# EAGLE board CombinedBackplane01 (EAGLE 7.7.0), part 1 of 2
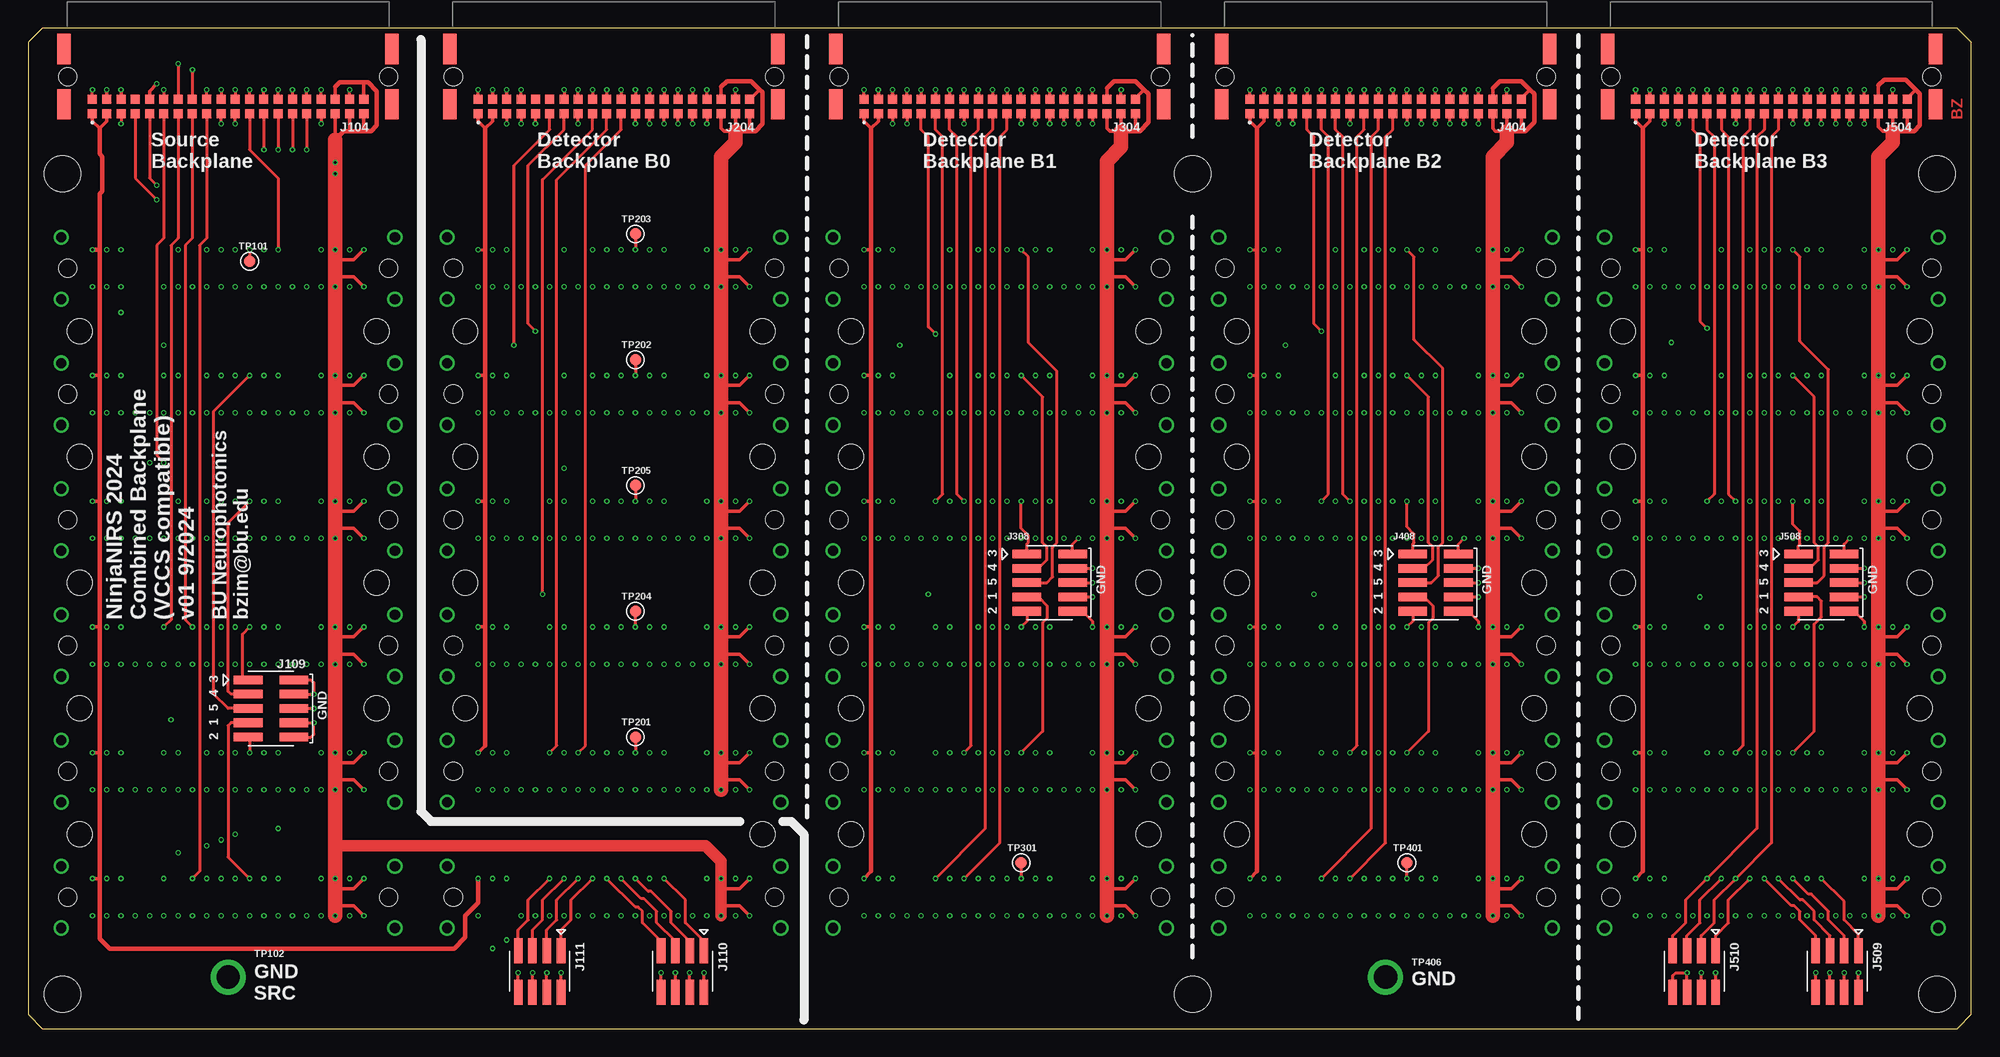
[diagram p5: board, top side]
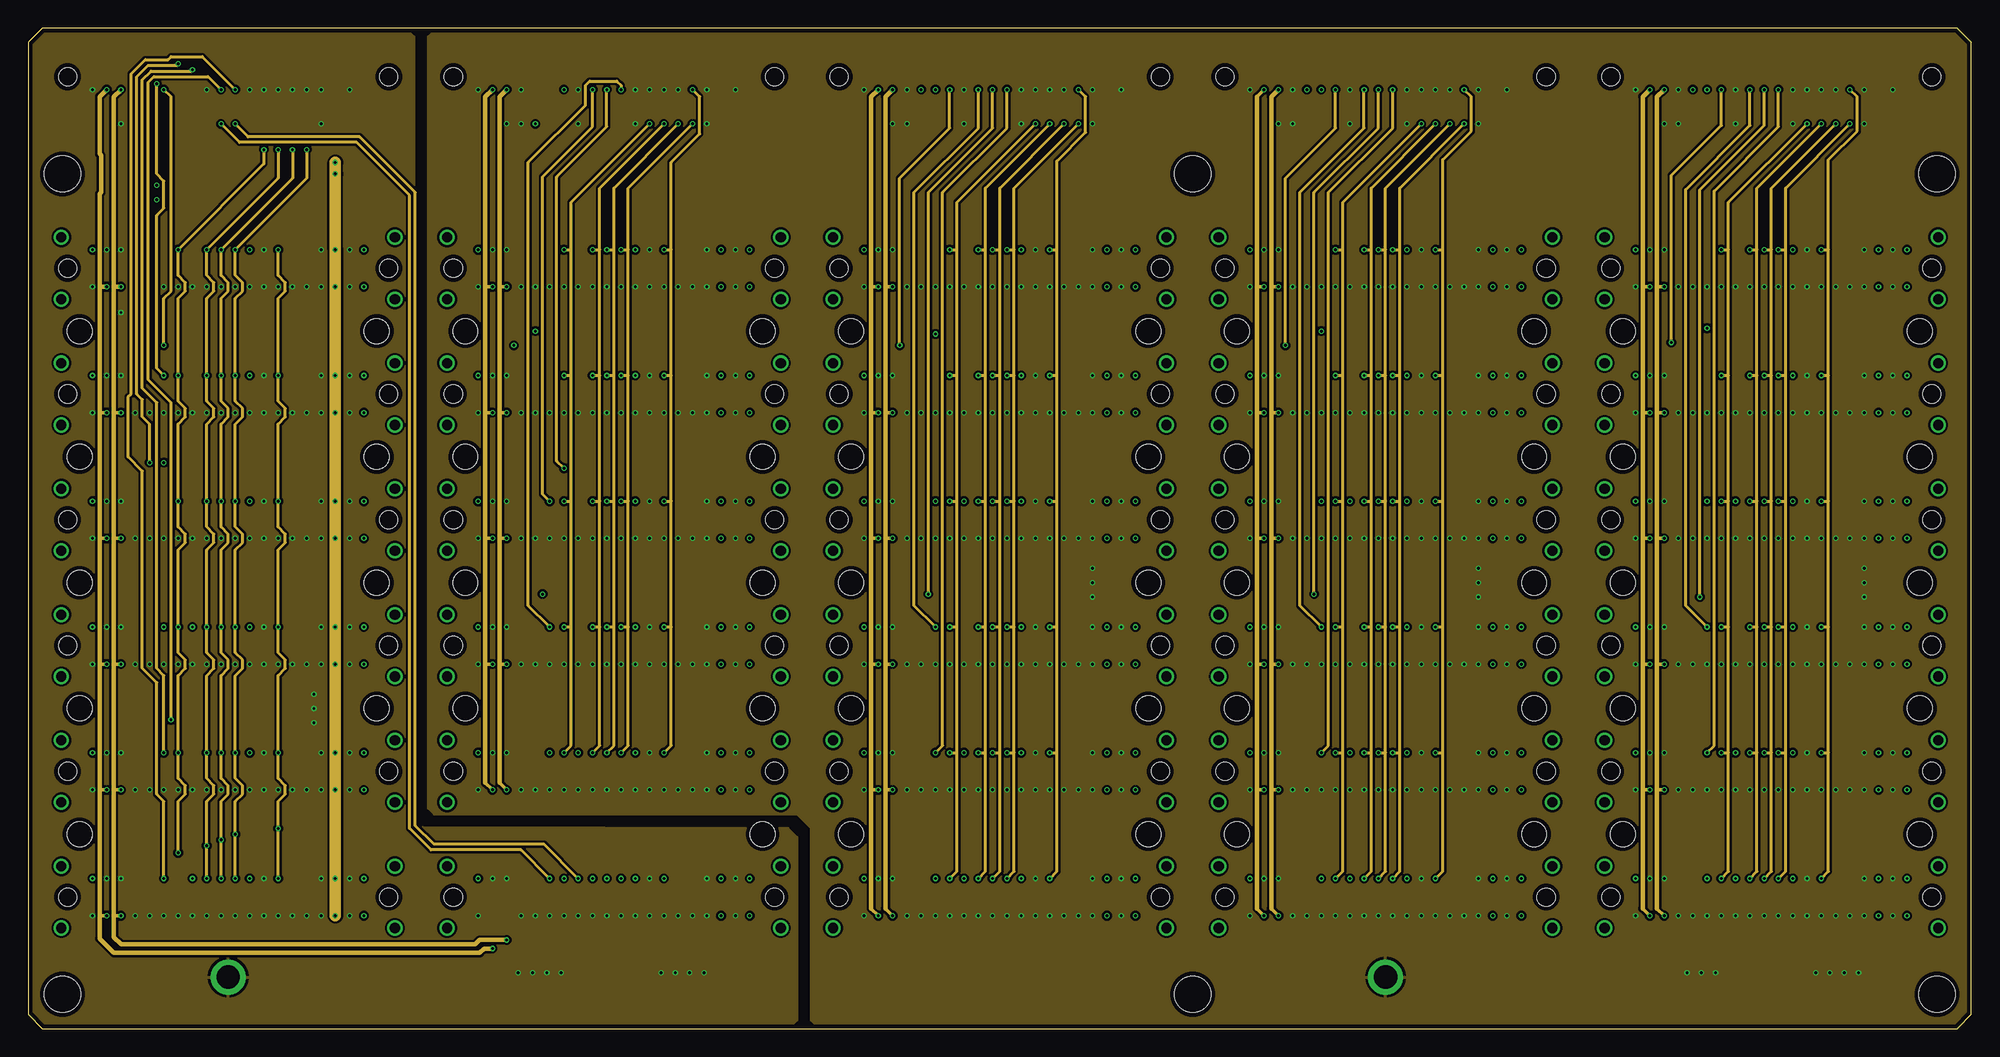
[diagram p6: board, inner layer Route2]
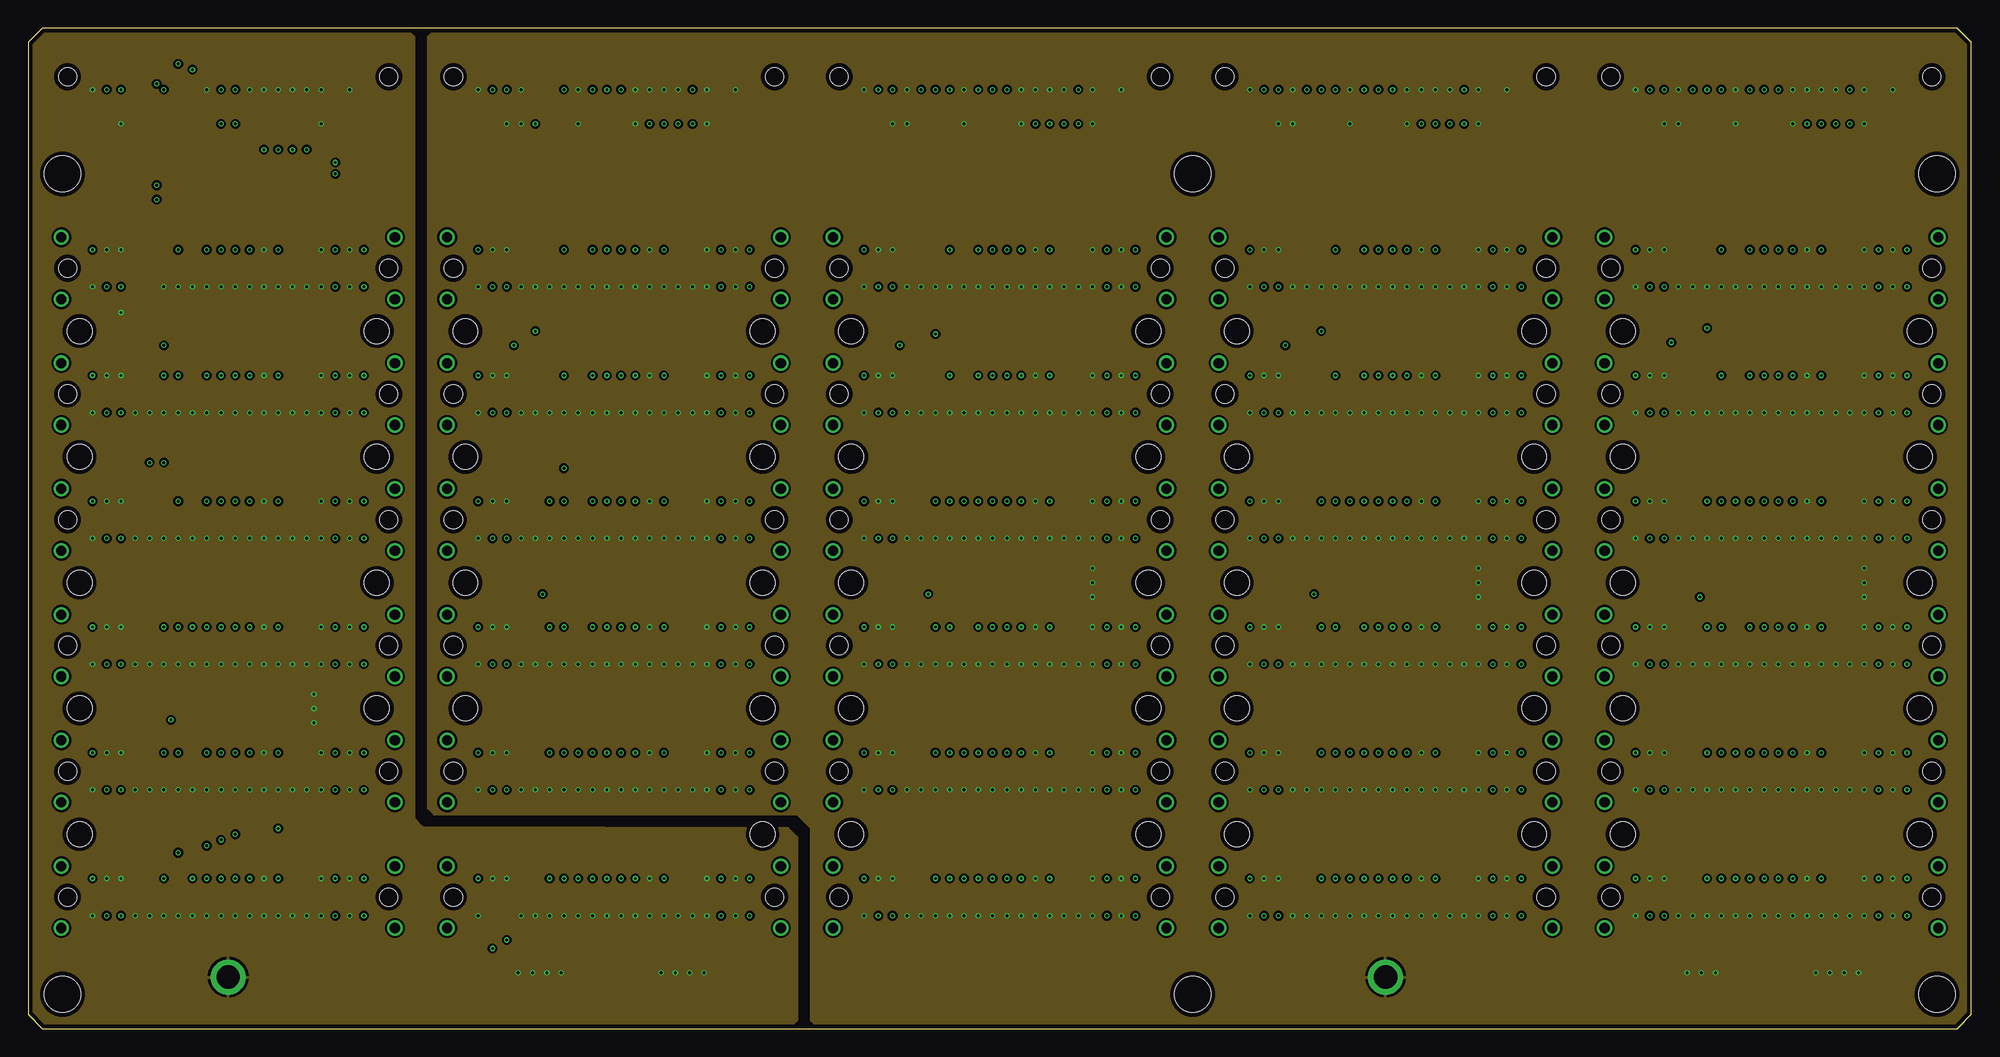
[diagram p7: board, inner layer Route15]
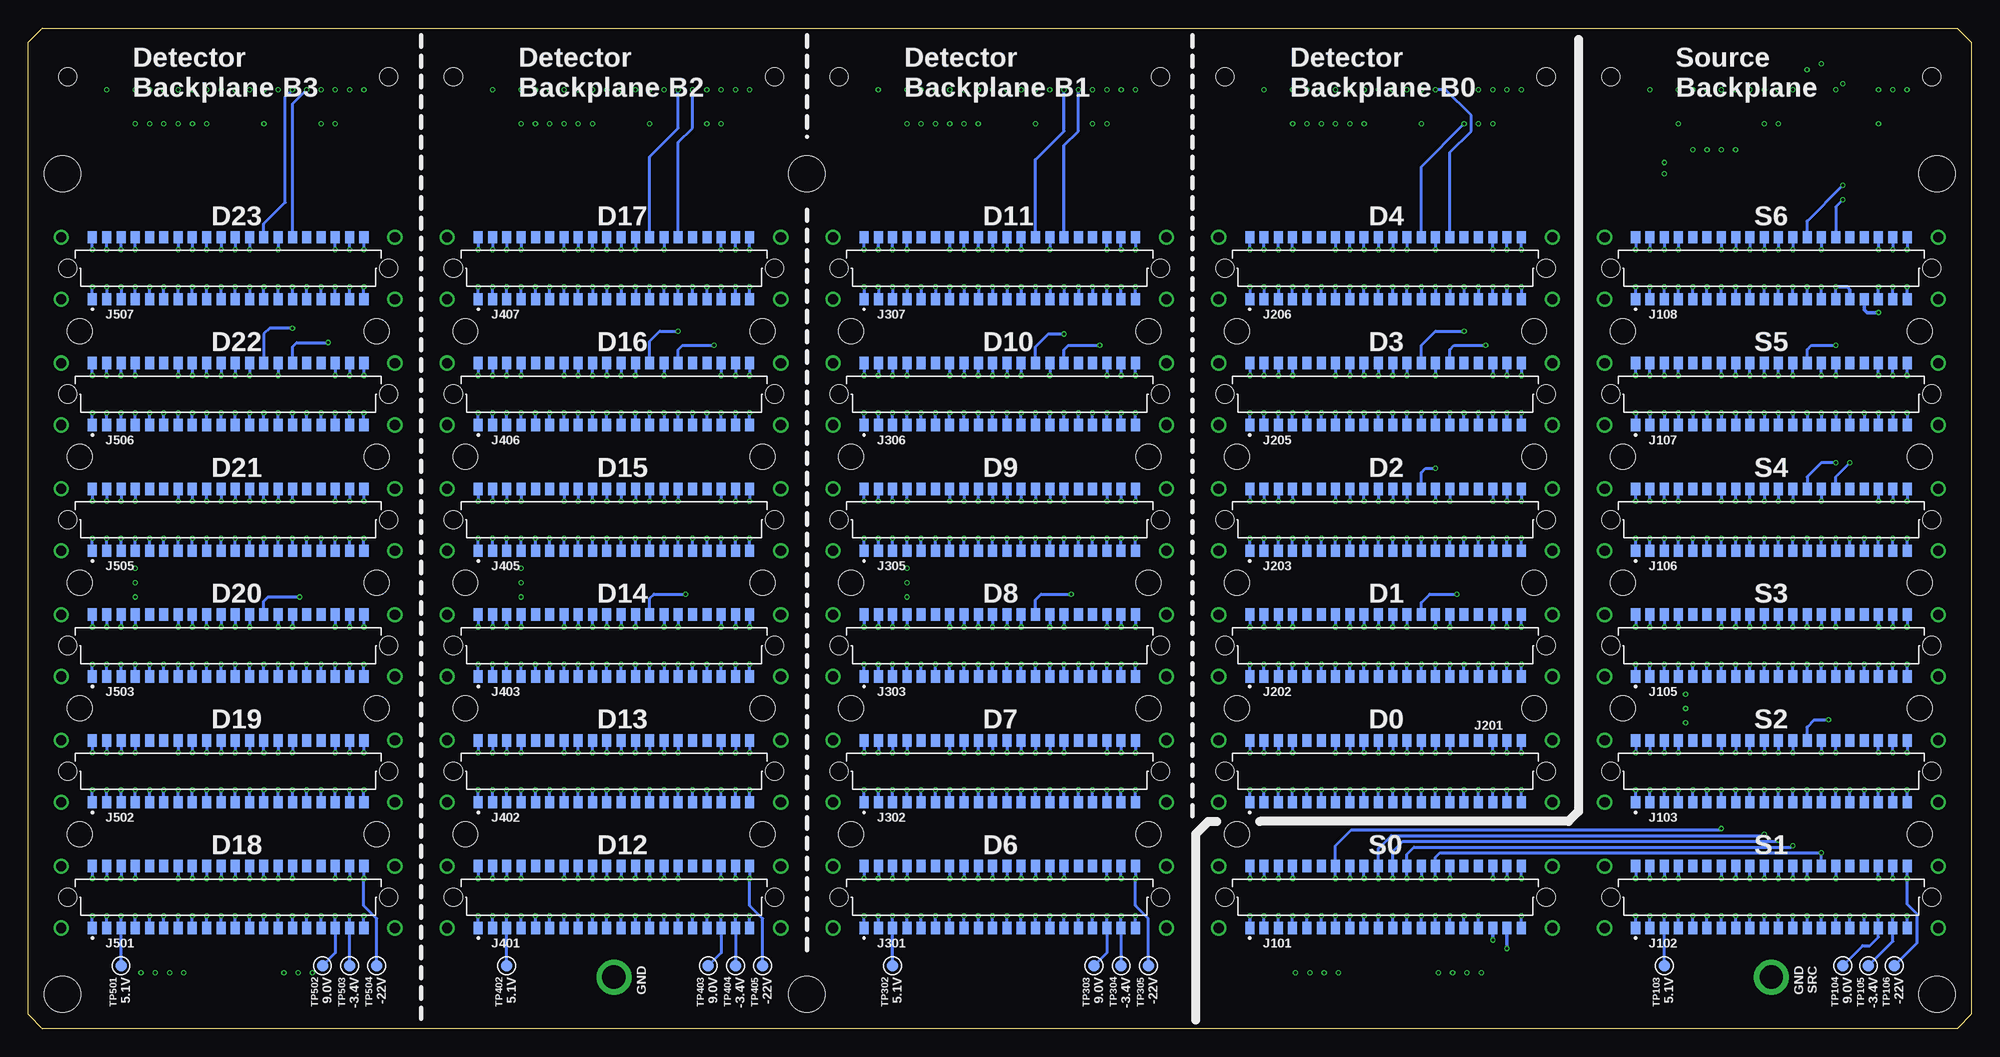
[diagram p8: board, bottom side, seen from below]

Size 172.72 x 88.9 mm. Coordinates in mm from the lower left corner, seen from the top.
Outline: 1.27,0 171.45,0 172.72,1.27 172.72,87.63 171.45,88.9 1.27,88.9 0,87.63 0,1.27 1.27,0
Copper layers (1*2*15*16): Top 0.035559375mm / dielectric 0.17018125mm / Route2 0.01778125mm / dielectric 47mil / Route15 0.01778125mm / dielectric 0.17018125mm / Bottom 0.035559375mm
Design rules "OSHPark-4layer *": minimum track width 5mil, minimum drill 10mil, track to track 5mil, track to pad 5mil, pad to pad 5mil, via to via 5mil, smd to smd 5mil, copper to edge 15mil, drill to drill 6mil, minimum pad ring 4mil, minimum via ring 4mil, stop-mask expansion 2.5mil, vias tented up to drill 12mil, thermal gap 10mil
Holes 2.2 mm at 4.57,28.45 4.57,17.27 30.99,28.45 4.57,39.62 4.57,50.8 30.99,39.62 30.99,50.8 4.57,61.98 30.99,61.98 38.86,28.45 38.86,39.62 38.86,50.8 38.86,61.98 73.15,28.45 73.15,17.27 73.15,39.62 73.15,50.8 73.15,61.98 107.44,28.45 107.44,17.27 107.44,39.62 107.44,50.8 107.44,61.98 141.73,28.45 141.73,17.27 141.73,39.62 141.73,50.8 141.73,61.98 65.28,28.45 65.28,39.62 65.28,50.8 65.28,61.98 99.57,28.45 99.57,17.27 99.57,39.62 99.57,50.8 99.57,61.98 133.86,28.45 133.86,17.27 133.86,39.62 133.86,50.8 133.86,61.98 168.15,28.45 168.15,17.27 168.15,39.62 168.15,50.8 168.15,61.98 65.28,17.27
Holes 3.2 mm at 3.05,3.05 169.67,3.05 103.5,3.05 103.5,75.95 169.67,75.95 3.05,75.95
tKeepout: area 100.5,72.9 to 106.6,79; area 166.6,72.9 to 172.7,79; area 0,0 to 6.1,6.1; area 100.5,0 to 106.6,6.1; area 166.6,0 to 172.7,6.1; area 0,72.9 to 6.1,79
tRestrict: 16 lines

## Footprints (pad centres in the part's own frame; a part is rotated, then mirrored left to right if it is on the bottom)
M20X2_HARFLEX_F_STR_MPTH = smd 0.8 x 1.1: A1 12.065,2.75; A2 10.795,2.75; A3 9.525,2.75; A4 8.255,2.75; A5 6.985,2.75; A6 5.715,2.75; A7 4.445,2.75; A8 3.175,2.75; A9 1.905,2.75; A10 0.635,2.75; A11 -0.635,2.75; A12 -1.905,2.75; A13 -3.175,2.75; A14 -4.445,2.75; A15 -5.715,2.75; A16 -6.985,2.75; A17 -8.255,2.75; A18 -9.525,2.75; A19 -10.795,2.75; A20 -12.065,2.75; B1 12.065,-2.75; B2 10.795,-2.75; B3 9.525,-2.75; B4 8.255,-2.75; B5 6.985,-2.75; B6 5.715,-2.75; B7 4.445,-2.75; B8 3.175,-2.75; B9 1.905,-2.75; B10 0.635,-2.75; B11 -0.635,-2.75; B12 -1.905,-2.75; B13 -3.175,-2.75; B14 -4.445,-2.75; B15 -5.715,-2.75; B16 -6.985,-2.75; B17 -8.255,-2.75; B18 -9.525,-2.75; B19 -10.795,-2.75; B20 -12.065,-2.75 | drill 0.9 pad 1.35: M1 -14.825,2.75; M2 14.825,2.75; M3 -14.825,-2.75; M4 14.825,-2.75 | hole 1.6: -14.275,0; 14.275,0
M20X2_HARFLEX_M = smd 0.8 x 0.8: A1 12.065,2; A2 10.795,2; A3 9.525,2; A4 8.255,2; A5 6.985,2; A6 5.715,2; A7 4.445,2; A8 3.175,2; A9 1.905,2; A10 0.635,2; A11 -0.635,2; A12 -1.905,2; A13 -3.175,2; A14 -4.445,2; A15 -5.715,2; A16 -6.985,2; A17 -8.255,2; A18 -9.525,2; A19 -10.795,2; A20 -12.065,2; B1 12.065,3.27; B2 10.795,3.27; B3 9.525,3.27; B4 8.255,3.27; B5 6.985,3.27; B6 5.715,3.27; B7 4.445,3.27; B8 3.175,3.27; B9 1.905,3.27; B10 0.635,3.27; B11 -0.635,3.27; B12 -1.905,3.27; B13 -3.175,3.27; B14 -4.445,3.27; B15 -5.715,3.27; B16 -6.985,3.27; B17 -8.255,3.27; B18 -9.525,3.27; B19 -10.795,3.27; B20 -12.065,3.27 | smd 1.2 x 2.7: P$17 -14.575,2.45; P$18 -14.575,-2.45; P$19 14.575,2.45; P$20 14.575,-2.45 | hole 1.6: -14.275,0; 14.275,0
M05X2_0.050_SMD_NO_CREAM = smd 2.54 x 0.762: 1 -2.032,2.54; 2 2.032,2.54; 3 -2.032,1.27; 4 2.032,1.27; 5 -2.032,0; 6 2.032,0; 7 -2.032,-1.27; 8 2.032,-1.27; 9 -2.032,-2.54; 10 2.032,-2.54
M04X2_0.050_SMD_NO_CREAM = smd 2.21 x 0.762: 1 -1.841,1.905; 2 1.841,1.905; 3 -1.841,0.635; 4 1.841,0.635; 5 -1.841,-0.635; 6 1.841,-0.635; 7 -1.841,-1.905; 8 1.841,-1.905
TESTPAD_ROUND = smd 1.016 x 1.016: P$1 0,0
TURRET = drill 2.08: P$1 0,0

## Placement (x,y rotation side)
J101  M20X2_STR_MPTH  [M20X2_HARFLEX_F_STR_MPTH]  52.07,11.68 180 bottom
J102  M20X2_STR_MPTH  [M20X2_HARFLEX_F_STR_MPTH]  17.78,11.68 180 bottom
J103  M20X2_STR_MPTH  [M20X2_HARFLEX_F_STR_MPTH]  17.78,22.86 180 bottom
J104  M20X2_HARFLEX_M  [M20X2_HARFLEX_M]  17.78,84.58 180 top
J105  M20X2_STR_MPTH  [M20X2_HARFLEX_F_STR_MPTH]  17.78,34.04 180 bottom
J106  M20X2_STR_MPTH  [M20X2_HARFLEX_F_STR_MPTH]  17.78,45.21 180 bottom
J107  M20X2_STR_MPTH  [M20X2_HARFLEX_F_STR_MPTH]  17.78,56.39 180 bottom
J108  M20X2_STR_MPTH  [M20X2_HARFLEX_F_STR_MPTH]  17.78,67.56 180 bottom
J109  M05X2_SMD_0.050_NOCREAM  [M05X2_0.050_SMD_NO_CREAM]  21.59,28.45 0 top
J110  M04X2_0.050_SMD_NO_CREAM  [M04X2_0.050_SMD_NO_CREAM]  58.17,5.08 270 top
J111  M04X2_0.050_SMD_NO_CREAM  [M04X2_0.050_SMD_NO_CREAM]  45.47,5.08 270 top
J201  M20X2_STR_MPTH  [M20X2_HARFLEX_F_STR_MPTH]  52.07,22.86 180 bottom
J202  M20X2_STR_MPTH  [M20X2_HARFLEX_F_STR_MPTH]  52.07,34.04 180 bottom
J203  M20X2_STR_MPTH  [M20X2_HARFLEX_F_STR_MPTH]  52.07,45.21 180 bottom
J204  M20X2_HARFLEX_M  [M20X2_HARFLEX_M]  52.07,84.58 180 top
J205  M20X2_STR_MPTH  [M20X2_HARFLEX_F_STR_MPTH]  52.07,56.39 180 bottom
J206  M20X2_STR_MPTH  [M20X2_HARFLEX_F_STR_MPTH]  52.07,67.56 180 bottom
J301  M20X2_STR_MPTH  [M20X2_HARFLEX_F_STR_MPTH]  86.36,11.68 180 bottom
J302  M20X2_STR_MPTH  [M20X2_HARFLEX_F_STR_MPTH]  86.36,22.86 180 bottom
J303  M20X2_STR_MPTH  [M20X2_HARFLEX_F_STR_MPTH]  86.36,34.04 180 bottom
J304  M20X2_HARFLEX_M  [M20X2_HARFLEX_M]  86.36,84.58 180 top
J305  M20X2_STR_MPTH  [M20X2_HARFLEX_F_STR_MPTH]  86.36,45.21 180 bottom
J306  M20X2_STR_MPTH  [M20X2_HARFLEX_F_STR_MPTH]  86.36,56.39 180 bottom
J307  M20X2_STR_MPTH  [M20X2_HARFLEX_F_STR_MPTH]  86.36,67.56 180 bottom
J308  M05X2_SMD_0.050_NOCREAM  [M05X2_0.050_SMD_NO_CREAM]  90.81,39.62 0 top
J401  M20X2_STR_MPTH  [M20X2_HARFLEX_F_STR_MPTH]  120.65,11.68 180 bottom
J402  M20X2_STR_MPTH  [M20X2_HARFLEX_F_STR_MPTH]  120.65,22.86 180 bottom
J403  M20X2_STR_MPTH  [M20X2_HARFLEX_F_STR_MPTH]  120.65,34.04 180 bottom
J404  M20X2_HARFLEX_M  [M20X2_HARFLEX_M]  120.65,84.58 180 top
J405  M20X2_STR_MPTH  [M20X2_HARFLEX_F_STR_MPTH]  120.65,45.21 180 bottom
J406  M20X2_STR_MPTH  [M20X2_HARFLEX_F_STR_MPTH]  120.65,56.39 180 bottom
J407  M20X2_STR_MPTH  [M20X2_HARFLEX_F_STR_MPTH]  120.65,67.56 180 bottom
J408  M05X2_SMD_0.050_NOCREAM  [M05X2_0.050_SMD_NO_CREAM]  125.09,39.62 0 top
J501  M20X2_STR_MPTH  [M20X2_HARFLEX_F_STR_MPTH]  154.94,11.68 180 bottom
J502  M20X2_STR_MPTH  [M20X2_HARFLEX_F_STR_MPTH]  154.94,22.86 180 bottom
J503  M20X2_STR_MPTH  [M20X2_HARFLEX_F_STR_MPTH]  154.94,34.04 180 bottom
J504  M20X2_HARFLEX_M  [M20X2_HARFLEX_M]  154.94,84.58 180 top
J505  M20X2_STR_MPTH  [M20X2_HARFLEX_F_STR_MPTH]  154.94,45.21 180 bottom
J506  M20X2_STR_MPTH  [M20X2_HARFLEX_F_STR_MPTH]  154.94,56.39 180 bottom
J507  M20X2_STR_MPTH  [M20X2_HARFLEX_F_STR_MPTH]  154.94,67.56 180 bottom
J508  M05X2_SMD_0.050_NOCREAM  [M05X2_0.050_SMD_NO_CREAM]  159.38,39.62 0 top
J509  M04X2_0.050_SMD_NO_CREAM  [M04X2_0.050_SMD_NO_CREAM]  160.78,5.08 270 top
J510  M04X2_0.050_SMD_NO_CREAM  [M04X2_0.050_SMD_NO_CREAM]  148.08,5.08 270 top
TP101  TESTPOINT_ROUND  [TESTPAD_ROUND]  19.68,68.2 0 top
TP102  TESTPOINTTUR  [TURRET]  17.78,4.57 0 top
TP103  TESTPOINT_ROUND  [TESTPAD_ROUND]  27.3,5.59 0 bottom
TP104  TESTPOINT_ROUND  [TESTPAD_ROUND]  11.43,5.59 0 bottom
TP105  TESTPOINT_ROUND  [TESTPAD_ROUND]  9.14,5.59 0 bottom
TP106  TESTPOINT_ROUND  [TESTPAD_ROUND]  6.86,5.59 0 bottom
TP201  TESTPOINT_ROUND  [TESTPAD_ROUND]  53.98,25.91 0 top
TP202  TESTPOINT_ROUND  [TESTPAD_ROUND]  53.98,59.44 0 top
TP203  TESTPOINT_ROUND  [TESTPAD_ROUND]  53.98,70.61 0 top
TP204  TESTPOINT_ROUND  [TESTPAD_ROUND]  53.98,37.08 0 top
TP205  TESTPOINT_ROUND  [TESTPAD_ROUND]  53.98,48.26 0 top
TP301  TESTPOINT_ROUND  [TESTPAD_ROUND]  88.27,14.73 0 top
TP302  TESTPOINT_ROUND  [TESTPAD_ROUND]  95.89,5.59 180 bottom
TP303  TESTPOINT_ROUND  [TESTPAD_ROUND]  77.98,5.59 180 bottom
TP304  TESTPOINT_ROUND  [TESTPAD_ROUND]  75.56,5.59 180 bottom
TP305  TESTPOINT_ROUND  [TESTPAD_ROUND]  73.15,5.59 180 bottom
TP401  TESTPOINT_ROUND  [TESTPAD_ROUND]  122.56,14.73 0 top
TP402  TESTPOINT_ROUND  [TESTPAD_ROUND]  130.18,5.59 180 bottom
TP403  TESTPOINT_ROUND  [TESTPAD_ROUND]  112.27,5.59 180 bottom
TP404  TESTPOINT_ROUND  [TESTPAD_ROUND]  109.86,5.59 180 bottom
TP405  TESTPOINT_ROUND  [TESTPAD_ROUND]  107.44,5.59 180 bottom
TP406  TESTPOINTTUR  [TURRET]  120.65,4.57 0 top
TP501  TESTPOINT_ROUND  [TESTPAD_ROUND]  164.47,5.59 180 bottom
TP502  TESTPOINT_ROUND  [TESTPAD_ROUND]  146.56,5.59 180 bottom
TP503  TESTPOINT_ROUND  [TESTPAD_ROUND]  144.15,5.59 180 bottom
TP504  TESTPOINT_ROUND  [TESTPAD_ROUND]  141.73,5.59 180 bottom

## Tracks (layer width: path | path; a pad name or v marks a point on that pad's centre or on a via)
DET0_C0  (via drill 0.25)
  Top 0.254: v59.05,80.39 J204.B16
  Route2 0.254: v52.7,24.51 53.34,25.15 53.34,35.69 | 53.34,35.69 53.34,46.86 | 53.34,46.86 53.34,58.04 | 53.34,58.04 53.34,69.22 | v52.7,69.22 53.34,69.22 | v52.7,58.04 53.34,58.04 | v52.7,46.86 53.34,46.86 | v52.7,35.69 53.34,35.69 | 53.34,69.22 53.34,74.68 v59.05,80.39
  Bottom 0.254: J206.B10 v52.7,69.22 | J205.B10 v52.7,58.04 | J203.B10 v52.7,46.86 | J202.B10 v52.7,35.69 | J201.B10 v52.7,24.51
DET0_C1  (via drill 0.25)
  Top 0.254: v57.78,80.39 J204.B15
  Route2 0.254: v51.44,24.51 52.07,25.15 52.07,35.69 | 52.07,35.69 52.07,46.86 | 52.07,46.86 52.07,58.04 | 52.07,58.04 52.07,69.22 | v51.44,69.22 52.07,69.22 | v51.44,58.04 52.07,58.04 | v51.44,46.86 52.07,46.86 | v51.44,35.69 52.07,35.69 | 52.07,69.22 52.07,74.68 v57.78,80.39
  Bottom 0.254: J206.B11 v51.44,69.22 | J205.B11 v51.44,58.04 | J203.B11 v51.44,46.86 | J202.B11 v51.44,35.69 | J201.B11 v51.44,24.51
DET0_C2  (via drill 0.25)
  Top 0.254: v56.52,80.39 J204.B14
  Route2 0.254: v50.16,24.51 50.8,25.15 50.8,35.69 | 50.8,35.69 50.8,46.86 | 50.8,46.86 50.8,58.04 | 50.8,58.04 50.8,69.22 | v50.16,69.22 50.8,69.22 | v50.16,58.04 50.8,58.04 | v50.16,46.86 50.8,46.86 | v50.16,35.69 50.8,35.69 | 50.8,69.22 50.8,74.68 v56.52,80.39
  Bottom 0.254: J206.B12 v50.16,69.22 | J205.B12 v50.16,58.04 | J203.B12 v50.16,46.86 | J202.B12 v50.16,35.69 | J201.B12 v50.16,24.51
DET0_C3  (via drill 0.25)
  Top 0.254: v55.24,80.39 J204.B13
  Route2 0.254: v47.62,24.51 48.26,25.15 48.26,35.69 | 48.26,35.69 48.26,46.86 | 48.26,46.86 48.26,58.04 | 48.26,58.04 48.26,69.22 | 48.26,69.22 48.26,73.41 v55.24,80.39 | v47.62,69.22 48.26,69.22 | v47.62,58.04 48.26,58.04 | v47.62,46.86 48.26,46.86 | v47.62,35.69 48.26,35.69
  Bottom 0.254: J206.B14 v47.62,69.22 | J205.B14 v47.62,58.04 | J203.B14 v47.62,46.86 | J202.B14 v47.62,35.69 | J201.B14 v47.62,24.51
DET0_D0  (via drill 0.25)
  Top 0.254: v48.9,24.51 49.53,25.15 49.53,76.71 52.7,79.88 J204.B11
  Bottom 0.254: J201.B13 v48.9,24.51
DET0_D1  (via drill 0.25)
  Top 0.254: v46.35,24.51 46.99,25.15 46.99,75.44 51.44,79.88 J204.B10
  Bottom 0.254: J201.B15 v46.35,24.51
DET0_D2  (via drill 0.25)
  Top 0.254: v45.72,38.61 45.72,75.44 50.16,79.88 J204.B9
  Bottom 0.254: J202.B13 48.9,37.85 48.13,38.61 v45.72,38.61
DET0_D3  (via drill 0.25)
  Top 0.254: v52.7,83.44 J204.A11
  Route2 0.254: v46.35,35.69 44.45,37.59 44.45,76.96 49.53,82.04 49.53,83.82 49.91,84.2 52.32,84.2 52.7,83.82 v52.7,83.44
  Bottom 0.254: J202.B15 v46.35,35.69
DET0_D4  (via drill 0.25)
  Top 0.254: v51.44,83.44 J204.A10
  Route2 0.254: v47.62,49.78 46.99,50.42 46.99,75.69 51.44,80.14 v51.44,83.44
  Bottom 0.254: J203.B13 48.9,49.4 48.51,49.78 v47.62,49.78
DET0_D5  (via drill 0.25)
  Top 0.254: v50.16,83.44 J204.A9
  Route2 0.254: v46.35,46.86 45.72,47.5 45.72,75.69 50.16,80.14 v50.16,83.44
  Bottom 0.254: J203.B15 v46.35,46.86
DET0_D6  (via drill 0.25)
  Top 0.254: v45.09,61.98 44.45,62.61 44.45,76.71 47.62,79.88 J204.B7
  Bottom 0.254: J205.B13 48.9,60.71 47.62,61.98 v45.09,61.98
DET0_D7  (via drill 0.25)
  Top 0.254: v43.18,60.71 43.18,76.71 46.35,79.88 J204.B6
  Bottom 0.254: J205.B15 46.35,60.33 45.97,60.71 v43.18,60.71
DET0_D8  (via drill 0.25)
  Top 0.254: v45.09,80.39 J204.B5
  Bottom 0.254: J206.B13 48.9,76.58 v45.09,80.39
DET0_D9  (via drill 0.25)
  Top 0.254: v47.62,83.44 J204.A7
  Bottom 0.254: J206.B15 46.35,77.85 44.45,79.76 44.45,81.15 46.74,83.44 v47.62,83.44
DET1_C0  (via drill 0.25)
  Top 0.254: v93.34,80.39 J304.B16
  Route2 0.254: v87,13.34 87.63,13.97 87.63,24.51 | 87.63,24.51 87.63,35.69 | 87.63,35.69 87.63,46.86 | 87.63,46.86 87.63,58.04 | 87.63,58.04 87.63,69.22 | v87,69.22 87.63,69.22 | v87,58.04 87.63,58.04 | v87,46.86 87.63,46.86 | v87,35.69 87.63,35.69 | v87,24.51 87.63,24.51 | 87.63,69.22 87.63,74.68 v93.34,80.39
  Bottom 0.254: J307.B10 v87,69.22 | J306.B10 v87,58.04 | J305.B10 v87,46.86 | J303.B10 v87,35.69 | J302.B10 v87,24.51 | J301.B10 v87,13.34
DET1_C1  (via drill 0.25)
  Top 0.254: v92.08,80.39 J304.B15
  Route2 0.254: v85.72,13.34 86.36,13.97 86.36,24.51 | 86.36,24.51 86.36,35.69 | 86.36,35.69 86.36,46.86 | 86.36,46.86 86.36,58.04 | 86.36,58.04 86.36,69.22 | v85.72,69.22 86.36,69.22 | v85.72,58.04 86.36,58.04 | v85.72,46.86 86.36,46.86 | v85.72,35.69 86.36,35.69 | v85.72,24.51 86.36,24.51 | 86.36,69.22 86.36,74.68 v92.08,80.39
  Bottom 0.254: J307.B11 v85.72,69.22 | J306.B11 v85.72,58.04 | J305.B11 v85.72,46.86 | J303.B11 v85.72,35.69 | J302.B11 v85.72,24.51 | J301.B11 v85.72,13.34
DET1_C2  (via drill 0.25)
  Top 0.254: v90.81,80.39 J304.B14
  Route2 0.254: v84.45,13.34 85.09,13.97 85.09,24.51 | 85.09,24.51 85.09,35.69 | 85.09,35.69 85.09,46.86 | 85.09,46.86 85.09,58.04 | 85.09,58.04 85.09,69.22 | v84.45,69.22 85.09,69.22 | v84.45,58.04 85.09,58.04 | v84.45,46.86 85.09,46.86 | v84.45,35.69 85.09,35.69 | v84.45,24.51 85.09,24.51 | 85.09,69.22 85.09,74.68 v90.81,80.39
  Bottom 0.254: J307.B12 v84.45,69.22 | J306.B12 v84.45,58.04 | J305.B12 v84.45,46.86 | J303.B12 v84.45,35.69 | J302.B12 v84.45,24.51 | J301.B12 v84.45,13.34
DET1_C3  (via drill 0.25)
  Top 0.254: v89.53,80.39 J304.B13
  Route2 0.254: v81.92,13.34 82.55,13.97 82.55,24.51 | 82.55,24.51 82.55,35.69 | 82.55,35.69 82.55,46.86 | 82.55,46.86 82.55,58.04 | 82.55,58.04 82.55,69.22 | 82.55,69.22 82.55,73.41 v89.53,80.39 | v81.92,69.22 82.55,69.22 | v81.92,58.04 82.55,58.04 | v81.92,46.86 82.55,46.86 | v81.92,35.69 82.55,35.69 | v81.92,24.51 82.55,24.51
  Bottom 0.254: J307.B14 v81.92,69.22 | J306.B14 v81.92,58.04 | J305.B14 v81.92,46.86 | J303.B14 v81.92,35.69 | J302.B14 v81.92,24.51 | J301.B14 v81.92,13.34
DET1_D0  (via drill 0.25)
  Top 0.254: v83.19,13.34 86.36,16.51 86.36,79.25 87,79.88 J304.B11
  Bottom 0.254: J301.B13 v83.19,13.34
DET1_D1  (via drill 0.25)
  Top 0.254: v80.64,13.34 85.09,17.78 85.09,79.25 85.72,79.88 J304.B10
  Bottom 0.254: J301.B15 v80.64,13.34
DET1_D2  (via drill 0.25)
  Top 0.254: v83.19,24.51 83.82,25.15 83.82,79.25 84.45,79.88 J304.B9
  Bottom 0.254: J302.B13 v83.19,24.51
DET1_D3  (via drill 0.25)
  Top 0.254: v87,83.44 J304.A11
  Route2 0.254: v80.64,24.51 81.28,25.15 81.28,74.3 87,80.01 v87,83.44
  Bottom 0.254: J302.B15 v80.64,24.51
DET1_D4  (via drill 0.25)
  Top 0.254: v85.72,83.44 J304.A10
  Route2 0.254: v80.01,38.61 80.01,74.3 85.72,80.01 v85.72,83.44
  Bottom 0.254: J303.B13 83.19,38.1 82.68,38.61 v80.01,38.61
DET1_D5  (via drill 0.25)
  Top 0.254: v84.45,83.44 J304.A9
  Route2 0.254: v80.64,35.69 78.74,37.59 78.74,74.3 84.45,80.01 v84.45,83.44
  Bottom 0.254: J303.B15 v80.64,35.69
DET1_D6  (via drill 0.25)
  Top 0.254: v83.19,46.86 82.55,47.5 82.55,79.25 81.92,79.88 J304.B7
  Bottom 0.254: J305.B13 v83.19,46.86
DET1_D7  (via drill 0.25)
  Top 0.254: v80.64,46.86 81.28,47.5 81.28,79.25 80.64,79.88 J304.B6
  Bottom 0.254: J305.B15 v80.64,46.86
DET1_D8  (via drill 0.25)
  Top 0.254: v80.64,61.72 80.01,62.36 80.01,79.25 79.38,79.88 J304.B5
  Bottom 0.254: J306.B13 83.19,60.58 82.04,61.72 v80.64,61.72
DET1_D9  (via drill 0.25)
  Top 0.254: v81.92,83.44 J304.A7
  Route2 0.254: v77.47,60.71 77.47,75.56 81.92,80.01 v81.92,83.44
  Bottom 0.254: J306.B15 80.64,60.33 80.26,60.71 v77.47,60.71
DET1_D10  (via drill 0.25)
  Top 0.254: v80.64,83.44 J304.A6
  Bottom 0.254: J307.B13 83.19,77.22 80.64,79.76 v80.64,83.44
DET1_D11  (via drill 0.25)
  Top 0.254: v79.38,83.44 J304.A5
  Bottom 0.254: J307.B15 80.64,78.49 79.38,79.76 v79.38,83.44
DET2_C0  (via drill 0.25)
  Top 0.254: v127.64,80.39 J404.B16
  Route2 0.254: v121.28,13.34 121.92,13.97 121.92,24.51 | 121.92,24.51 121.92,35.69 | 121.92,35.69 121.92,46.86 | 121.92,46.86 121.92,58.04 | 121.92,58.04 121.92,69.22 | v121.28,24.51 121.92,24.51 | v121.28,35.69 121.92,35.69 | v121.28,46.86 121.92,46.86 | v121.28,58.04 121.92,58.04 | v121.28,69.22 121.92,69.22 | 121.92,69.22 121.92,74.68 v127.64,80.39
  Bottom 0.254: J401.B10 v121.28,13.34 | J402.B10 v121.28,24.51 | J403.B10 v121.28,35.69 | J405.B10 v121.28,46.86 | J406.B10 v121.28,58.04 | J407.B10 v121.28,69.22
DET2_C1  (via drill 0.25)
  Top 0.254: v126.36,80.39 J404.B15
  Route2 0.254: v120.02,13.34 120.65,13.97 120.65,24.51 | 120.65,24.51 120.65,35.69 | 120.65,35.69 120.65,46.86 | 120.65,46.86 120.65,58.04 | 120.65,58.04 120.65,69.22 | v120.02,24.51 120.65,24.51 | v120.02,35.69 120.65,35.69 | v120.02,46.86 120.65,46.86 | v120.02,58.04 120.65,58.04 | v120.02,69.22 120.65,69.22 | 120.65,69.22 120.65,74.68 v126.36,80.39
  Bottom 0.254: J401.B11 v120.02,13.34 | J402.B11 v120.02,24.51 | J403.B11 v120.02,35.69 | J405.B11 v120.02,46.86 | J406.B11 v120.02,58.04 | J407.B11 v120.02,69.22
DET2_C2  (via drill 0.25)
  Top 0.254: v125.09,80.39 J404.B14
  Route2 0.254: v118.75,13.34 119.38,13.97 119.38,24.51 | 119.38,24.51 119.38,35.69 | 119.38,35.69 119.38,46.86 | 119.38,46.86 119.38,58.04 | 119.38,58.04 119.38,69.22 | v118.75,24.51 119.38,24.51 | v118.75,35.69 119.38,35.69 | v118.75,46.86 119.38,46.86 | v118.75,58.04 119.38,58.04 | v118.75,69.22 119.38,69.22 | 119.38,69.22 119.38,74.68 v125.09,80.39
  Bottom 0.254: J401.B12 v118.75,13.34 | J402.B12 v118.75,24.51 | J403.B12 v118.75,35.69 | J405.B12 v118.75,46.86 | J406.B12 v118.75,58.04 | J407.B12 v118.75,69.22
DET2_C3  (via drill 0.25)
  Top 0.254: v123.83,80.39 J404.B13
  Route2 0.254: v116.2,13.34 116.84,13.97 116.84,24.51 | 116.84,24.51 116.84,35.69 | 116.84,35.69 116.84,46.86 | 116.84,46.86 116.84,58.04 | 116.84,58.04 116.84,69.22 | 116.84,69.22 116.84,73.41 v123.83,80.39 | v116.2,24.51 116.84,24.51 | v116.2,35.69 116.84,35.69 | v116.2,46.86 116.84,46.86 | v116.2,58.04 116.84,58.04 | v116.2,69.22 116.84,69.22
  Bottom 0.254: J401.B14 v116.2,13.34 | J402.B14 v116.2,24.51 | J403.B14 v116.2,35.69 | J405.B14 v116.2,46.86 | J406.B14 v116.2,58.04 | J407.B14 v116.2,69.22
DET2_D0  (via drill 0.25)
  Top 0.254: v117.47,13.34 120.65,16.51 120.65,79.25 121.28,79.88 J404.B11
  Bottom 0.254: J401.B13 v117.47,13.34
DET2_D1  (via drill 0.25)
  Top 0.254: v114.94,13.34 119.38,17.78 119.38,79.25 120.02,79.88 J404.B10
  Bottom 0.254: J401.B15 v114.94,13.34
DET2_D2  (via drill 0.25)
  Top 0.254: v117.47,24.51 118.11,25.15 118.11,79.25 118.75,79.88 J404.B9
  Bottom 0.254: J402.B13 v117.47,24.51
DET2_D3  (via drill 0.25)
  Top 0.254: v121.28,83.44 J404.A11
  Route2 0.254: v114.94,24.51 115.57,25.15 115.57,74.3 121.28,80.01 v121.28,83.44
  Bottom 0.254: J402.B15 v114.94,24.51
DET2_D4  (via drill 0.25)
  Top 0.254: v120.02,83.44 J404.A10
  Route2 0.254: v114.3,38.61 114.3,74.3 120.02,80.01 v120.02,83.44
  Bottom 0.254: J403.B13 117.47,38.23 117.09,38.61 v114.3,38.61
DET2_D5  (via drill 0.25)
  Top 0.254: v118.75,83.44 J404.A9
  Route2 0.254: v114.94,35.69 113.03,37.59 113.03,74.3 118.75,80.01 v118.75,83.44
  Bottom 0.254: J403.B15 v114.94,35.69
DET2_D6  (via drill 0.25)
  Top 0.254: v117.47,46.86 116.84,47.5 116.84,79.25 116.2,79.88 J404.B7
  Bottom 0.254: J405.B13 v117.47,46.86
DET2_D7  (via drill 0.25)
  Top 0.254: v114.94,46.86 115.57,47.5 115.57,79.25 114.94,79.88 J404.B6
  Bottom 0.254: J405.B15 v114.94,46.86
DET2_D8  (via drill 0.25)
  Top 0.254: v114.94,61.98 114.3,62.61 114.3,79.25 113.67,79.88 J404.B5
  Bottom 0.254: J406.B13 117.47,61.09 116.59,61.98 v114.94,61.98
DET2_D9  (via drill 0.25)
  Top 0.254: v116.2,83.44 J404.A7
  Route2 0.254: v111.76,60.71 111.76,75.56 116.2,80.01 v116.2,83.44
  Bottom 0.254: J406.B15 114.94,60.33 114.55,60.71 v111.76,60.71
DET2_D10  (via drill 0.25)
  Top 0.254: v114.94,83.44 J404.A6
  Bottom 0.254: J407.B13 117.47,77.47 114.94,80.01 v114.94,83.44
DET2_D11  (via drill 0.25)
  Top 0.254: v113.67,83.44 J404.A5
  Bottom 0.254: J407.B15 114.94,78.74 113.67,80.01 v113.67,83.44
DET3_C0  (via drill 0.25)
  Top 0.254: v161.93,80.39 J504.B16 | J509.5 160.15,8.26 158.75,9.65 158.75,10.41 157.73,11.43 157.48,11.43 v155.57,13.34
  Route2 0.254: v155.57,13.34 156.21,13.97 156.21,24.51 | 156.21,24.51 156.21,35.69 | 156.21,35.69 156.21,46.86 | 156.21,46.86 156.21,58.04 | 156.21,58.04 156.21,69.22 | v155.57,69.22 156.21,69.22 | v155.57,58.04 156.21,58.04 | v155.57,46.86 156.21,46.86 | v155.57,35.69 156.21,35.69 | v155.57,24.51 156.21,24.51 | 156.21,69.22 156.21,74.68 v161.93,80.39
  Bottom 0.254: J501.B10 v155.57,13.34 | J507.B10 v155.57,69.22 | J506.B10 v155.57,58.04 | J505.B10 v155.57,46.86 | J503.B10 v155.57,35.69 | J502.B10 v155.57,24.51
DET3_C1  (via drill 0.25)
  Top 0.254: v160.66,80.39 J504.B15 | J509.7 158.88,8.26 157.48,9.65 157.48,10.41 156.97,10.92 156.72,10.92 v154.31,13.34
  Route2 0.254: v154.31,13.34 154.94,13.97 154.94,24.51 | 154.94,24.51 154.94,35.69 | 154.94,35.69 154.94,46.86 | 154.94,46.86 154.94,58.04 | 154.94,58.04 154.94,69.22 | v154.31,69.22 154.94,69.22 | v154.31,58.04 154.94,58.04 | v154.31,46.86 154.94,46.86 | v154.31,35.69 154.94,35.69 | v154.31,24.51 154.94,24.51 | 154.94,69.22 154.94,74.68 v160.66,80.39
  Bottom 0.254: J501.B11 v154.31,13.34 | J507.B11 v154.31,69.22 | J506.B11 v154.31,58.04 | J505.B11 v154.31,46.86 | J503.B11 v154.31,35.69 | J502.B11 v154.31,24.51
DET3_C2  (via drill 0.25)
  Top 0.254: v159.38,80.39 J504.B14 | J510.1 149.99,8.26 151.13,9.4 151.13,11.43 v153.03,13.34
  Route2 0.254: v153.03,13.34 153.67,13.97 153.67,24.51 | 153.67,24.51 153.67,35.69 | 153.67,35.69 153.67,46.86 | 153.67,46.86 153.67,58.04 | 153.67,58.04 153.67,69.22 | v153.03,58.04 153.67,58.04 | v153.03,35.69 153.67,35.69 | v153.03,69.22 153.67,69.22 | v153.03,24.51 153.67,24.51 | v153.03,46.86 153.67,46.86 | 153.67,69.22 153.67,74.68 v159.38,80.39
  Bottom 0.254: J501.B12 v153.03,13.34 | J506.B12 v153.03,58.04 | J505.B12 v153.03,46.86 | J503.B12 v153.03,35.69 | J502.B12 v153.03,24.51 | J507.B12 v153.03,69.22
DET3_C3  (via drill 0.25)
  Top 0.254: v158.12,80.39 J504.B13 | J510.5 147.45,8.26 148.59,9.4 148.59,11.43 v150.5,13.34
  Route2 0.254: v150.5,13.34 151.13,13.97 151.13,24.51 | 151.13,24.51 151.13,35.69 | 151.13,35.69 151.13,46.86 | 151.13,46.86 151.13,58.04 | 151.13,58.04 151.13,69.22 | v150.5,69.22 151.13,69.22 | v150.5,58.04 151.13,58.04 | v150.5,46.86 151.13,46.86 | v150.5,35.69 151.13,35.69 | v150.5,24.51 151.13,24.51 | 151.13,69.22 151.13,73.41 v158.12,80.39
  Bottom 0.254: J501.B14 v150.5,13.34 | J507.B14 v150.5,69.22 | J506.B14 v150.5,58.04 | J505.B14 v150.5,46.86 | J503.B14 v150.5,35.69 | J502.B14 v150.5,24.51
DET3_D0  (via drill 0.25)
  Top 0.254: J504.B11 155.57,79.88 154.94,79.25 154.94,16.51 v151.76,13.34 149.86,11.43 149.86,9.4 148.72,8.26 J510.3
  Bottom 0.254: v151.76,13.34 J501.B13
DET3_D1  (via drill 0.25)
  Top 0.254: J504.B10 154.31,79.88 153.67,79.25 153.67,17.78 v149.22,13.34 147.32,11.43 147.32,9.4 146.18,8.26 J510.7
  Bottom 0.254: v149.22,13.34 J501.B15
DET3_D2  (via drill 0.25)
  Top 0.254: J504.B9 153.03,79.88 152.4,79.25 152.4,25.15 v151.76,24.51
  Bottom 0.254: v151.76,24.51 J502.B13
DET3_D3  (via drill 0.25)
  Top 0.254: v155.57,83.44 J504.A11
  Route2 0.254: v149.22,24.51 149.86,25.15 149.86,74.42 155.57,80.14 v155.57,83.44
  Bottom 0.254: J502.B15 v149.22,24.51
DET3_D4  (via drill 0.25)
  Top 0.254: v154.31,83.44 J504.A10
  Route2 0.254: v148.59,38.35 148.59,74.55 154.31,80.26 v154.31,83.44
  Bottom 0.254: J503.B13 151.76,37.97 151.38,38.35 v148.59,38.35
DET3_D5  (via drill 0.25)
  Top 0.254: v153.03,83.44 J504.A9
  Route2 0.254: v149.22,35.69 147.32,37.59 147.32,74.55 153.03,80.26 v153.03,83.44
  Bottom 0.254: J503.B15 v149.22,35.69
DET3_D6  (via drill 0.25)
  Top 0.254: J504.B7 150.5,79.88 151.13,79.25 151.13,47.5 v151.76,46.86
  Bottom 0.254: v151.76,46.86 J505.B13
DET3_D7  (via drill 0.25)
  Top 0.254: J504.B6 149.22,79.88 149.86,79.25 149.86,47.5 v149.22,46.86
  Bottom 0.254: v149.22,46.86 J505.B15
DET3_D8  (via drill 0.25)
  Top 0.254: J504.B5 147.96,79.88 148.59,79.25 148.59,62.87 v149.22,62.23
  Bottom 0.254: v149.22,62.23 151.26,62.23 151.76,61.72 J506.B13
DET3_D9  (via drill 0.25)
  Top 0.254: v150.5,83.44 J504.A7
  Route2 0.254: v146.05,60.96 146.05,75.82 150.5,80.26 v150.5,83.44
  Bottom 0.254: J506.B15 149.22,60.58 148.84,60.96 v146.05,60.96
DET3_D10  (via drill 0.25)
  Top 0.254: v149.22,83.44 J504.A6
  Bottom 0.254: J507.B13 151.76,71.5 149.86,73.41 149.86,82.8 v149.22,83.44
DET3_D11  (via drill 0.25)
  Top 0.254: v147.96,83.44 J504.A5
  Bottom 0.254: J507.B15 149.22,82.17 v147.96,83.44
DETB0_RUN  (via drill 0.25)
  Top 0.254: v59.05,83.44 J204.A16
  Route2 0.254: v56.52,24.51 57.15,25.15 57.15,35.69 | 57.15,35.69 57.15,46.86 | 57.15,46.86 57.15,58.04 | 57.15,58.04 57.15,69.22 | v56.52,69.22 57.15,69.22 | v56.52,35.69 57.15,35.69 | 57.15,69.22 57.15,76.96 59.69,79.5 59.69,82.8 v59.05,83.44 | v56.52,46.86 57.15,46.86 | v56.52,58.04 57.15,58.04
  Bottom 0.254: J206.B7 v56.52,69.22 | J205.B7 v56.52,58.04 | J203.B7 v56.52,46.86 | J202.B7 v56.52,35.69 | J201.B7 v56.52,24.51
DETB1_RUN  (via drill 0.25)
  Top 0.254: v93.34,83.44 J304.A16
  Route2 0.254: v90.81,13.34 91.44,13.97 91.44,24.51 | 91.44,24.51 91.44,35.69 | 91.44,35.69 91.44,46.86 | 91.44,46.86 91.44,58.04 | 91.44,58.04 91.44,69.22 | v90.81,58.04 91.44,58.04 | v90.81,46.86 91.44,46.86 | v90.81,35.69 91.44,35.69 | v90.81,24.51 91.44,24.51 | v90.81,69.22 91.44,69.22 | 91.44,69.22 91.44,77.09 93.98,79.63 93.98,82.8 v93.34,83.44
  Bottom 0.254: J306.B7 v90.81,58.04 | J305.B7 v90.81,46.86 | J303.B7 v90.81,35.69 | J302.B7 v90.81,24.51 | J301.B7 v90.81,13.34 | J307.B7 v90.81,69.22
DETB2_RUN  (via drill 0.25)
  Top 0.254: v127.64,83.44 J404.A16
  Route2 0.254: v125.09,13.34 125.73,13.97 125.73,24.51 | 125.73,24.51 125.73,35.69 | 125.73,35.69 125.73,46.86 | 125.73,46.86 125.73,58.04 | 125.73,58.04 125.73,69.22 | v125.09,24.51 125.73,24.51 | v125.09,35.69 125.73,35.69 | v125.09,46.86 125.73,46.86 | v125.09,58.04 125.73,58.04 | v125.09,69.22 125.73,69.22 | 125.73,69.22 125.73,77.22 128.27,79.76 128.27,82.8 v127.64,83.44
  Bottom 0.254: J401.B7 v125.09,13.34 | J402.B7 v125.09,24.51 | J403.B7 v125.09,35.69 | J405.B7 v125.09,46.86 | J406.B7 v125.09,58.04 | v125.09,69.22 J407.B7
DETB3_RUN  (via drill 0.25)
  Top 0.254: v161.93,83.44 J504.A16 | J509.1 162.69,8.38 161.42,9.65 161.42,11.3 v159.38,13.34
  Route2 0.254: v159.38,13.34 160.02,13.97 160.02,24.51 | 160.02,24.51 160.02,35.69 | 160.02,35.69 160.02,46.86 | 160.02,46.86 160.02,58.04 | 160.02,58.04 160.02,69.22 | v159.38,69.22 160.02,69.22 | v159.38,58.04 160.02,58.04 | v159.38,46.86 160.02,46.86 | v159.38,35.69 160.02,35.69 | v159.38,24.51 160.02,24.51 | 160.02,69.22 160.02,77.22 162.56,79.76 162.56,82.8 v161.93,83.44
  Bottom 0.254: J501.B7 v159.38,13.34 | J507.B7 v159.38,69.22 | J506.B7 v159.38,58.04 | J505.B7 v159.38,46.86 | J503.B7 v159.38,35.69 | J502.B7 v159.38,24.51
GND  (via drill 0.25)
  Top 0.254: J304.A17 v94.61,83.44 | J304.B17 v94.61,80.39 | J304.A19 v97.16,83.44 | J304.A15 v92.08,83.44 | J304.A14 v90.81,83.44 | J304.A13 v89.53,83.44 | J304.A12 v88.27,83.44 | J304.B12 v88.27,80.39 | J304.A8 v83.19,83.44 | J304.B8 v83.19,80.39 | J304.A4 v78.11,83.44 | J304.B4 v78.11,80.39 | J304.B3 v76.83,80.39 | J304.A1 v74.3,83.44 | J404.A1 v108.58,83.44 | J404.A4 v112.39,83.44 | J404.B3 v111.12,80.39 | J404.B4 v112.39,80.39 | J404.B8 v117.47,80.39 | J404.A8 v117.47,83.44 | J404.A12 v122.56,83.44 | J404.A13 v123.83,83.44 | J404.A14 v125.09,83.44 | J404.A15 v126.36,83.44 | J404.B12 v122.56,80.39 | J404.A17 v128.91,83.44 | J404.B17 v128.91,80.39 | J404.A19 v131.44,83.44 | J504.A1 v142.88,83.44 | J504.A4 v146.69,83.44 | J504.B4 v146.69,80.39 | J504.B3 v145.41,80.39 | J504.A8 v151.76,83.44 | J504.B8 v151.76,80.39 | J504.A12 v156.84,83.44 | J504.A13 v158.12,83.44 | J504.A14 v159.38,83.44 | J504.A15 v160.66,83.44 | J504.A17 v163.19,83.44 | J504.A19 v165.74,83.44 | J504.B17 v163.19,80.39 | J504.B12 v156.84,80.39 | J508.4 v163.19,40.89 | J508.6 v163.19,39.62 | J508.8 v163.19,38.35 | J508.10 162.31,37.08 163.19,36.2 v163.19,35.69 | J508.2 161.42,43.05 v161.93,43.56 | J204.B17 v60.33,80.39 | J204.A17 v60.33,83.44 | J204.A15 v57.78,83.44 | v56.52,83.44 J204.A14 | v55.24,83.44 J204.A13 | v53.98,83.44 J204.A12 | J204.A19 v62.87,83.44 | J204.A8 v48.9,83.44 | v48.9,80.39 J204.B8 | v53.98,80.39 J204.B12 | J204.B4 v43.81,80.39 | J204.B3 v42.55,80.39 | J204.A4 v43.81,83.44 | J308.4 v94.61,40.89 | J308.6 v94.61,39.62 | J308.8 v94.61,38.35 | J308.10 93.73,37.08 94.61,36.2 v94.61,35.69 | J308.2 92.84,43.05 v93.34,43.56 | J408.2 127.13,43.05 v127.64,43.56 | J408.4 v128.91,40.89 | J408.6 v128.91,39.62 | J408.8 v128.91,38.35
  Top 0.254: J408.10 128.02,37.08 128.91,36.2 v128.91,35.69 | J204.A1 v40.01,83.44 | J510.6 v147.45,4.95 146.43,4.95 146.18,4.7 J510.8 | J510.4 v148.72,4.95 | J510.2 v149.99,4.95 | J509.8 v158.88,4.95 | J509.6 v160.15,4.95 | J509.4 v161.42,4.95 | J509.2 v162.69,4.95
  Bottom 0.254: v41.27,69.22 J206.B19 | v42.55,69.22 J206.B18 | v40.01,65.91 J206.A20 | v43.81,65.91 J206.A17 | v45.09,65.91 J206.A16 | v46.35,65.91 J206.A15 | v47.62,65.91 J206.A14 | v48.9,65.91 J206.A13 | v55.24,69.22 J206.B8 | v60.33,69.22 J206.B4 | v62.87,69.22 J206.B2 | v62.87,65.91 J206.A2 | J206.A4 v60.33,65.91 | J206.A5 v59.05,65.91 | J206.A6 v57.78,65.91 | J206.A7 v56.52,65.91 | J206.A8 v55.24,65.91 | J206.A9 v53.98,65.91 | J206.A10 v52.7,65.91 | J206.A11 v51.44,65.91 | J206.A12 v50.16,65.91 | J205.A17 v43.81,54.74 | J205.A16 v45.09,54.74 | J205.A15 v46.35,54.74 | J205.A14 v47.62,54.74 | J205.A13 v48.9,54.74 | J205.A12 v50.16,54.74 | J205.A11 v51.44,54.74 | J205.A10 v52.7,54.74 | J205.A8 v55.24,54.74 | J205.A6 v57.78,54.74 | J205.A5 v59.05,54.74 | J205.A4 v60.33,54.74 | J205.A2 v62.87,54.74 | J205.B4 v60.33,58.04 | J205.B2 v62.87,58.04 | J205.B8 v55.24,58.04 | J203.B4 v60.33,46.86 | J203.B2 v62.87,46.86 | J203.A2 v62.87,43.56 | J203.A4 v60.33,43.56 | J203.A5 v59.05,43.56 | J203.A6 v57.78,43.56 | J203.B8 v55.24,46.86 | J203.A8 v55.24,43.56 | J203.A7 v56.52,43.56 | J203.A9 v53.98,43.56 | J203.A10 v52.7,43.56 | J203.A11 v51.44,43.56 | J203.A12 v50.16,43.56 | J203.A13 v48.9,43.56 | J203.A14 v47.62,43.56 | J203.A15 v46.35,43.56 | J203.A16 v45.09,43.56 | J203.A17 v43.81,43.56 | J203.A20 v40.01,43.56 | J203.B18 v42.55,46.86 | J203.B19 v41.27,46.86 | J202.B4 v60.33,35.69 | J202.B2 v62.87,35.69 | J202.A2 v62.87,32.38 | J202.A4 v60.33,32.38 | J202.A5 v59.05,32.38 | J202.A6 v57.78,32.38 | J202.A7 v56.52,32.38 | J202.A8 v55.24,32.38 | J202.A9 v53.98,32.38 | J202.A10 v52.7,32.38 | J202.A11 v51.44,32.38 | J202.A12 v50.16,32.38 | J202.A13 v48.9,32.38 | J202.A14 v47.62,32.38 | J202.A15 v46.35,32.38 | J202.A16 v45.09,32.38
  Bottom 0.254: J202.A17 v43.81,32.38 | J202.A20 v40.01,32.38 | v42.55,35.69 J202.B18 | v41.27,35.69 J202.B19 | J202.B8 v55.24,35.69 | v42.55,24.51 J201.B18 | v41.27,24.51 J201.B19 | J201.A20 v40.01,21.21 | J201.A17 v43.81,21.21 | J201.A16 v45.09,21.21 | J201.A15 v46.35,21.21 | J201.A14 v47.62,21.21 | J201.A13 v48.9,21.21 | J201.A12 v50.16,21.21 | J201.A11 v51.44,21.21 | J201.A10 v52.7,21.21 | J201.A9 v53.98,21.21 | J201.A8 v55.24,21.21 | J201.A7 v56.52,21.21 | J201.A6 v57.78,21.21 | J201.A5 v59.05,21.21 | J201.A4 v60.33,21.21 | J201.A2 v62.87,21.21 | J201.B2 v62.87,24.51 | J201.B4 v60.33,24.51 | J201.B8 v55.24,24.51 | v78.11,65.91 J307.A17 | v79.38,65.91 J307.A16 | 76.83,70.23 J307.B18 v76.83,69.22 | v75.56,69.22 J307.B19 | v89.53,69.22 J307.B8 | v94.61,69.22 J307.B4 | v97.16,69.22 J307.B2 | v97.16,65.91 J307.A2 | v94.61,65.91 J307.A4 | v93.34,65.91 J307.A5 | v92.08,65.91 J307.A6 | v90.81,65.91 J307.A7 | v89.53,65.91 J307.A8 | v88.27,65.91 J307.A9 | v87,65.91 J307.A10 | v85.72,65.91 J307.A11 | v84.45,65.91 J307.A12 | v83.19,65.91 J307.A13 | v81.92,65.91 J307.A14 | v80.64,65.91 J307.A15 | v165.74,58.04 J506.B2 | J506.A2 v165.74,54.74 | J506.A4 v163.19,54.74 | J506.A5 v161.93,54.74 | J506.A6 v160.66,54.74 | J505.B4 v163.19,46.86 | J505.B2 v165.74,46.86 | J505.A4 v163.19,43.56 | J505.A5 v161.93,43.56 | J505.A2 v165.74,43.56 | J503.B4 v163.19,35.69 | J503.B2 v165.74,35.69 | J503.A2 v165.74,32.38 | J502.A6 v160.66,21.21 | J502.A7 v159.38,21.21 | J502.A8 v158.12,21.21 | J502.A5 v161.93,21.21 | J502.A4 v163.19,21.21 | J502.A2 v165.74,21.21 | J502.B2 v165.74,24.51 | J502.B4 v163.19,24.51 | J501.B4 v163.19,13.34 | J501.B2 v165.74,13.34 | J501.A8 v158.12,10.03 | J501.A7 v159.38,10.03 | J501.A6 v160.66,10.03 | J501.A5 v161.93,10.03
  Bottom 0.254: J501.A4 v163.19,10.03 | J501.A2 v165.74,10.03 | v165.74,69.22 J507.B2 | v163.19,69.22 J507.B4 | v165.74,65.91 J507.A2 | J507.A4 v163.19,65.91 | J507.A5 v161.93,65.91 | J507.A6 v160.66,65.91 | J507.A8 v158.12,65.91 | J507.A7 v159.38,65.91 | J507.B8 v158.12,69.22 | J507.A20 v142.88,65.91 | J506.A20 v142.88,54.74 | J505.A20 v142.88,43.56 | J503.A20 v142.88,32.38 | J502.A20 v142.88,21.21 | J502.A17 v146.69,21.21 | J502.A16 v147.96,21.21 | J502.A15 v149.22,21.21 | J502.A13 v151.76,21.21 | J502.A9 v156.84,21.21 | J501.A17 v146.69,10.03 | J501.A16 v147.96,10.03 | J501.A15 v149.22,10.03 | J501.A14 v150.5,10.03 | J501.A13 v151.76,10.03 | J501.A12 v153.03,10.03 | J501.A20 v142.88,10.03 | J501.A11 v154.31,10.03 | J501.A10 v155.57,10.03 | J501.A9 v156.84,10.03 | J501.B18 v145.41,13.34 | J501.B19 v144.15,13.34 | J506.B19 v144.15,58.04 | J506.B18 v145.41,58.04 | J506.A16 v147.96,54.74 | J505.B19 v144.15,46.86 | J505.B18 v145.41,46.86 | J503.B19 v144.15,35.69 | J503.B18 v145.41,35.69 | J503.A17 v146.69,32.38 | J503.A16 v147.96,32.38 | J503.A15 v149.22,32.38 | J502.B19 v144.15,24.51 | J502.B18 v145.41,24.51 | v144.15,69.22 J507.B19 | v145.41,69.22 J507.B18 | J507.A17 v146.69,65.91 | J507.A16 v147.96,65.91 | J505.A17 v146.69,43.56 | J505.A16 v147.96,43.56 | J505.A15 v149.22,43.56 | J505.A14 v150.5,43.56 | J505.A13 v151.76,43.56 | J505.A12 v153.03,43.56 | J505.A11 v154.31,43.56 | J505.A10 v155.57,43.56 | J505.A9 v156.84,43.56 | J505.A8 v158.12,43.56 | J505.A6 v160.66,43.56 | J505.A7 v159.38,43.56 | J505.B8 v158.12,46.86 | J403.B4 v128.91,35.69 | J403.B2 v131.44,35.69 | J403.B8 v123.83,35.69 | J403.A4 v128.91,32.38 | J403.A5 v127.64,32.38 | J403.A2 v131.44,32.38 | J403.A17 v112.39,32.38 | J403.A16 v113.67,32.38
  Bottom 0.254: J403.A15 v114.94,32.38 | J403.A13 v117.47,32.38 | v109.86,13.34 J401.B19 | v111.12,13.34 J401.B18 | J401.A20 v108.58,10.03 | J401.A17 v112.39,10.03 | J401.A16 v113.67,10.03 | J401.A15 v114.94,10.03 | J401.A14 v116.2,10.03 | J401.A13 v117.47,10.03 | J401.A12 v118.75,10.03 | J401.A11 v120.02,10.03 | J401.A10 v121.28,10.03 | J401.A9 v122.56,10.03 | J401.A8 v123.83,10.03 | J401.A7 v125.09,10.03 | J401.A6 v126.36,10.03 | J401.A5 v127.64,10.03 | J401.A4 v128.91,10.03 | J401.A2 v131.44,10.03 | J401.B2 v131.44,13.34 | J401.B4 v128.91,13.34 | v123.83,13.34 J401.B8 | J402.A17 v112.39,21.21 | J402.A16 v113.67,21.21 | J402.A15 v114.94,21.21 | J402.A14 v116.2,21.21 | J402.A13 v117.47,21.21 | J402.A12 v118.75,21.21 | J402.A11 v120.02,21.21 | J402.A10 v121.28,21.21 | J402.A9 v122.56,21.21 | J402.A8 v123.83,21.21 | J402.A7 v125.09,21.21 | J402.A6 v126.36,21.21 | J402.A5 v127.64,21.21 | J402.A4 v128.91,21.21 | J402.A2 v131.44,21.21 | J402.B2 v131.44,24.51 | J402.B4 v128.91,24.51 | v123.83,24.51 J402.B8 | J403.A12 v118.75,32.38 | J403.A11 v120.02,32.38 | J403.A10 v121.28,32.38 | J403.A9 v122.56,32.38 | J403.A8 v123.83,32.38 | J403.A7 v125.09,32.38 | J403.B18 v111.12,35.69 | J403.B19 v109.86,35.69 | J403.A20 v108.58,32.38 | J405.A17 v112.39,43.56 | J405.A16 v113.67,43.56 | J405.A15 v114.94,43.56 | J405.A14 v116.2,43.56 | J405.A20 v108.58,43.56 | J405.A13 v117.47,43.56 | J405.A12 v118.75,43.56 | J405.A11 v120.02,43.56 | J405.A10 v121.28,43.56 | J405.A8 v123.83,43.56 | J405.A9 v122.56,43.56 | J405.A7 v125.09,43.56 | J405.A6 v126.36,43.56 | J405.A5 v127.64,43.56 | J405.A4 v128.91,43.56 | J405.A2 v131.44,43.56 | J405.B4 v128.91,46.86 | J405.B2 v131.44,46.86 | J405.B8 v123.83,46.86 | J405.B18 v111.12,46.86
  Bottom 0.254: J405.B19 v109.86,46.86 | J407.A17 v112.39,65.91 | J407.A16 v113.67,65.91 | J407.A15 v114.94,65.91 | J407.A14 v116.2,65.91 | J407.A13 v117.47,65.91 | v120.02,65.91 J407.A11 | v121.28,65.91 J407.A10 | v118.75,65.91 J407.A12 | v122.56,65.91 J407.A9 | J407.A8 v123.83,65.91 | J407.A6 v126.36,65.91 | J407.A5 v127.64,65.91 | J407.A4 v128.91,65.91 | J407.A7 v125.09,65.91 | J407.A2 v131.44,65.91 | J407.B4 v128.91,69.22 | J407.B2 v131.44,69.22 | J407.B8 v123.83,69.22 | v109.86,69.22 J407.B19 | v111.12,69.22 J407.B18 | J407.A20 v108.58,65.91 | J406.A17 v112.39,54.74 | J406.A16 v113.67,54.74 | J406.A20 v108.58,54.74 | J406.B19 v109.86,58.04 | J406.B18 v111.12,58.04 | J406.A8 v123.83,54.74 | J406.A6 v126.36,54.74 | J406.A7 v125.09,54.74 | J406.A5 v127.64,54.74 | J406.A4 v128.91,54.74 | J406.A2 v131.44,54.74 | J406.B4 v128.91,58.04 | J406.B2 v131.44,58.04 | J406.B8 v123.83,58.04 | v116.2,54.74 J406.A14 | J406.A13 v117.47,54.74 | J406.A15 v114.94,54.74 | J406.A12 v118.75,54.74 | J406.A11 v120.02,54.74 | J406.A10 v121.28,54.74 | J406.A9 v122.56,54.74 | v94.61,46.86 J305.B4 | v97.16,46.86 J305.B2 | J305.A4 v94.61,43.56 | J305.A5 v93.34,43.56 | J305.A6 v92.08,43.56 | J305.A7 v90.81,43.56 | J305.A8 v89.53,43.56 | J305.A9 v88.27,43.56 | J305.A10 v87,43.56 | J305.A2 v97.16,43.56 | J305.A11 v85.72,43.56 | J305.A12 v84.45,43.56 | J305.A13 v83.19,43.56 | J305.A14 v81.92,43.56 | J305.A15 v80.64,43.56 | J305.A16 v79.38,43.56 | J305.A17 v78.11,43.56 | J305.A20 v74.3,43.56 | J305.B19 v75.56,46.86 | J305.B18 v76.83,46.86 | J305.B8 v89.53,46.86 | J306.A4 v94.61,54.74 | J306.A5 v93.34,54.74 | J306.A6 v92.08,54.74 | J306.A7 v90.81,54.74 | J306.A8 v89.53,54.74 | J306.A2 v97.16,54.74 | J306.B4 v94.61,58.04 | J306.B2 v97.16,58.04
  Bottom 0.254: J306.B8 v89.53,58.04 | J306.B18 v76.83,58.04 | J306.B19 v75.56,58.04 | J306.A20 v74.3,54.74 | J307.A20 v74.3,65.91 | v75.56,13.34 J301.B19 | v76.83,13.34 J301.B18 | J302.A20 v74.3,21.21 | J302.B19 v75.56,24.51 | J302.B18 v76.83,24.51 | J303.A17 v78.11,32.38 | J303.A16 v79.38,32.38 | J303.A15 v80.64,32.38 | J303.A14 v81.92,32.38 | J303.A13 v83.19,32.38 | J303.A12 v84.45,32.38 | J303.A11 v85.72,32.38 | J303.A10 v87,32.38 | J303.B19 v75.56,35.69 | J303.B18 v76.83,35.69 | J303.A20 v74.3,32.38 | J303.A9 v88.27,32.38 | J303.A8 v89.53,32.38 | J303.A7 v90.81,32.38 | J303.A5 v93.34,32.38 | J303.A4 v94.61,32.38 | J303.A2 v97.16,32.38 | J303.B2 v97.16,35.69 | J303.B4 v94.61,35.69 | J306.A17 v78.11,54.74 | J306.A16 v79.38,54.74 | J306.A15 v80.64,54.74 | J306.A14 v81.92,54.74 | J306.A13 v83.19,54.74 | J306.A12 v84.45,54.74 | J306.A11 v85.72,54.74 | J306.A10 v87,54.74 | J306.A9 v88.27,54.74 | J502.A10 v155.57,21.21 | J502.A11 v154.31,21.21 | J502.A12 v153.03,21.21 | J502.A14 v150.5,21.21 | J502.B8 v158.12,24.51 | J503.A13 v151.76,32.38 | J503.A12 v153.03,32.38 | J503.A11 v154.31,32.38 | J503.A10 v155.57,32.38 | J503.A8 v158.12,32.38 | J503.A7 v159.38,32.38 | J503.A5 v161.93,32.38 | J503.A4 v163.19,32.38 | J503.A14 v150.5,32.38 | J503.B8 v158.12,35.69 | J205.B18 v42.55,58.04 | J205.B19 v41.27,58.04 | J205.A20 v40.01,54.74 | J507.A10 v155.57,65.91 | J507.A9 v156.84,65.91 | J507.A11 v154.31,65.91 | v153.03,65.91 J507.A12 | J507.A13 v151.76,65.91 | J507.A14 v150.5,65.91 | J507.A15 v149.22,65.91 | J506.A14 v150.5,54.74 | J506.A15 v149.22,54.74 | J506.A13 v151.76,54.74 | J506.A12 v153.03,54.74 | J506.A11 v154.31,54.74 | J506.A10 v155.57,54.74 | J506.A9 v156.84,54.74 | J506.A8 v158.12,54.74 | J506.A7 v159.38,54.74
  Bottom 0.254: J506.B8 v158.12,58.04 | v163.19,58.04 J506.B4 | J506.A17 v146.69,54.74 | J501.B8 v158.12,13.34 | J503.A6 v160.66,32.38 | J503.A9 v156.84,32.38 | J301.A17 v78.11,10.03 | J301.A20 v74.3,10.03 | J301.A16 v79.38,10.03 | J301.A15 v80.64,10.03 | J301.A14 v81.92,10.03 | J301.A13 v83.19,10.03 | J301.A12 v84.45,10.03 | J301.A11 v85.72,10.03 | J301.A10 v87,10.03 | J301.A9 v88.27,10.03 | J301.A8 v89.53,10.03 | J301.A7 v90.81,10.03 | J301.A6 v92.08,10.03 | J301.A5 v93.34,10.03 | J301.A4 v94.61,10.03 | J301.A2 v97.16,10.03 | J301.B4 v94.61,13.34 | J301.B2 v97.16,13.34 | J302.A8 v89.53,21.21 | J302.A9 v88.27,21.21 | J302.A6 v92.08,21.21 | J302.A5 v93.34,21.21 | J302.A4 v94.61,21.21 | J302.A2 v97.16,21.21 | J301.B8 v89.53,13.34 | J302.A17 v78.11,21.21 | J302.A16 v79.38,21.21 | J302.A15 v80.64,21.21 | J302.A13 v83.19,21.21 | J302.A14 v81.92,21.21 | J302.A12 v84.45,21.21 | J302.A11 v85.72,21.21 | J302.A10 v87,21.21 | J302.A7 v90.81,21.21 | J302.B2 v97.16,24.51 | J302.B4 v94.61,24.51 | J302.B8 v89.53,24.51 | J402.A20 v108.58,21.21 | J402.B19 v109.86,24.51 | J402.B18 v111.12,24.51 | v56.52,54.74 J205.A7 | J303.B8 v89.53,35.69 | J205.A9 v53.98,54.74 | J303.A6 v92.08,32.38 | J403.A6 v126.36,32.38 | v116.2,32.38 J403.A14
  pour Route15 (isolate 0.203, rank 3): 35.56,88.14 36.32,88.9 172.72,88.9 172.72,0 70.36,0 69.6,0.76 69.6,17.78 68.33,19.05 36.07,19.05 35.56,19.56
  pour Route2 (isolate 0.203, rank 4): 35.56,88.14 36.32,88.9 172.72,88.9 172.72,0 70.36,0 69.6,0.76 69.6,17.78 68.33,19.05 36.07,19.05 35.56,19.56
GND_SRC  (via drill 0.25)
  Top 0.254: J109.2 25.15,30.99 25.4,30.73 v25.4,29.72 J109.4 | J109.10 25.15,25.91 25.4,26.16 v25.4,27.18 J109.8 | J109.6 v25.4,28.45 | J104.A19 v28.57,83.44 | J104.A17 v26.04,83.44 | J104.A16 v24.77,83.44 | J104.A15 v23.5,83.44 | J104.A14 v22.23,83.44 | J104.A13 v20.95,83.44 | J104.B17 v26.04,80.39 | J104.A12 v19.68,83.44 | J104.A9 v15.88,83.44 | J104.B3 v8.26,80.39 | J104.A1 v5.71,83.44 | J111.4 v46.1,4.95 | J111.6 v44.83,4.95 | J111.8 v43.56,4.95 | J111.2 v47.37,4.95 | J110.8 v56.26,4.95 | J110.6 v57.53,4.95 | J110.4 v58.8,4.95 | J110.2 v60.07,4.95
  Bottom 0.254: J105.B19 v6.99,35.69 | J105.B18 v8.26,35.69 | J105.A20 v5.71,32.38 | J105.A16 v10.79,32.38 | J105.A17 v9.53,32.38 | J105.A15 v12.06,32.38 | J105.A14 v13.34,32.38 | J105.A13 v14.61,32.38 | J105.A12 v15.88,32.38 | J105.A11 v17.14,32.38 | J105.A10 v18.41,32.38 | J105.A9 v19.68,32.38 | J105.A8 v20.95,32.38 | J105.A6 v23.5,32.38 | J105.A5 v24.77,32.38 | J105.A4 v26.04,32.38 | J105.A7 v22.23,32.38 | J105.A2 v28.57,32.38 | J105.B4 v26.04,35.69 | J105.B2 v28.57,35.69 | J105.B8 v20.95,35.69 | J103.B4 v26.04,24.51 | J103.B2 v28.57,24.51 | J103.A2 v28.57,21.21 | J103.A5 v24.77,21.21 | J103.A4 v26.04,21.21 | J103.A7 v22.23,21.21 | J103.A8 v20.95,21.21 | J103.B8 v20.95,24.51 | J103.A9 v19.68,21.21 | J103.A10 v18.41,21.21 | J103.A11 v17.14,21.21 | J103.A12 v15.88,21.21 | J103.A13 v14.61,21.21 | J103.A14 v13.34,21.21 | J103.A15 v12.06,21.21 | J103.A16 v10.79,21.21 | J103.A17 v9.53,21.21 | J103.A20 v5.71,21.21 | v6.99,24.51 J103.B19 | v8.26,24.51 J103.B18 | J103.A6 v23.5,21.21 | v8.26,13.34 J102.B18 | v6.99,13.34 J102.B19 | J102.A20 v5.71,10.03 | J102.A17 v9.53,10.03 | J102.A16 v10.79,10.03 | J102.A15 v12.06,10.03 | J102.A14 v13.34,10.03 | J102.A12 v15.88,10.03 | J102.A10 v18.41,10.03 | J102.A9 v19.68,10.03 | J102.A8 v20.95,10.03 | J102.A7 v22.23,10.03 | J102.A6 v23.5,10.03 | J102.A5 v24.77,10.03 | J102.A4 v26.04,10.03 | v28.57,13.34 J102.B2 | J102.B4 v26.04,13.34 | J102.A2 v28.57,10.03 | J102.B8 v20.95,13.34 | J102.A11 v17.14,10.03 | v28.57,58.04 J107.B2 | v26.04,58.04 J107.B4 | v26.04,54.74 J107.A4 | v28.57,54.74 J107.A2 | v24.77,54.74 J107.A5 | v23.5,54.74 J107.A6 | v22.23,54.74 J107.A7 | v20.95,58.04 J107.B8 | v20.95,54.74 J107.A8 | v19.68,54.74 J107.A9 | v18.41,54.74 J107.A10 | v17.14,54.74 J107.A11 | v15.88,54.74 J107.A12
  Bottom 0.254: v14.61,54.74 J107.A13 | v13.34,54.74 J107.A14 | v12.06,54.74 J107.A15 | v10.79,54.74 J107.A16 | v9.53,54.74 J107.A17 | v5.71,54.74 J107.A20 | v6.99,58.04 J107.B19 | v8.26,58.04 J107.B18 | v28.57,46.86 J106.B2 | v26.04,46.86 J106.B4 | v20.95,46.86 J106.B8 | J106.A2 v28.57,43.56 | J106.A4 v26.04,43.56 | J106.A5 v24.77,43.56 | J106.A6 v23.5,43.56 | J106.A7 v22.23,43.56 | J106.A8 v20.95,43.56 | J106.A9 v19.68,43.56 | J106.A10 v18.41,43.56 | J106.A12 v15.88,43.56 | J106.A13 v14.61,43.56 | J106.A14 v13.34,43.56 | J106.A15 v12.06,43.56 | J106.A16 v10.79,43.56 | J106.A17 v9.53,43.56 | J106.A20 v5.71,43.56 | J106.B18 v8.26,46.86 | J106.B19 v6.99,46.86 | J102.A13 v14.61,10.03 | J106.A11 v17.14,43.56 | J108.A13 v14.61,65.91 | J108.A15 v12.06,65.91 | J108.A14 v13.34,65.91 | J108.A12 v15.88,65.91 | J108.A11 v17.14,65.91 | J108.A10 v18.41,65.91 | J108.A9 v19.68,65.91 | J108.A8 v20.95,65.91 | J108.A7 v22.23,65.91 | J108.A6 v23.5,65.91 | J108.A5 v24.77,65.91 | J108.A4 v26.04,65.91 | J108.A2 v28.57,65.91 | J108.B2 v28.57,69.22 | J108.B4 v26.04,69.22 | J108.B8 v20.95,69.22 | J108.B18 v8.26,69.22 | J108.B19 v6.99,69.22 | J108.A20 v5.71,65.91 | J101.B2 v62.87,13.34 | J101.B4 v60.33,13.34 | J101.A6 v57.78,10.03 | J101.A5 v59.05,10.03 | J101.A4 v60.33,10.03 | J101.A2 v62.87,10.03 | J101.B8 v55.24,13.34 | J101.A8 v55.24,10.03 | J101.A7 v56.52,10.03 | J101.A9 v53.98,10.03 | J101.A10 v52.7,10.03 | J101.A11 v51.44,10.03 | J101.A12 v50.16,10.03 | J101.A13 v48.9,10.03 | J101.A14 v47.62,10.03 | J101.A15 v46.35,10.03 | J101.A20 v40.01,10.03 | J101.A17 v43.81,10.03 | J101.B18 v42.55,13.34 | J101.B19 v41.27,13.34 | J101.A16 v45.09,10.03
  Bottom 0.305: v8.26,63.63 9.27,63.63 9.53,63.88 J108.A17 | J108.A16 10.79,65.66 11.05,65.91 v12.06,65.91
  pour Route2 (isolate 0.203, rank 2): 0,88.9 33.53,88.9 34.29,88.14 34.29,18.67 35.05,17.91 67.56,17.78 68.33,17.02 68.33,0.76 67.56,0 0,0
  pour Route15 (isolate 0.203, rank 2): 0,88.9 33.53,88.9 34.29,88.14 34.29,18.67 35.05,17.91 67.56,17.78 68.33,17.02 68.33,0.76 67.56,0 0,0
N$2  (via drill 0.25)
  Top 0.254: TP201.P$1 v53.98,24.51
  Bottom 0.254: v53.98,24.51 J201.B9
N$3  (via drill 0.25)
  Top 0.254: TP301.P$1 v88.27,13.34
  Bottom 0.254: v88.27,13.34 J301.B9
N$4  (via drill 0.25)
  Top 0.254: v122.56,13.34 TP401.P$1
  Bottom 0.254: J401.B9 v122.56,13.34
RES0_1  (via drill 0.25)
  Top 0.254: v53.98,35.69 TP204.P$1
  Bottom 0.254: J202.B9 v53.98,35.69
RES0_2  (via drill 0.25)
  Top 0.254: TP205.P$1 v53.98,46.86
  Bottom 0.254: v53.98,46.86 J203.B9
RES0_3  (via drill 0.25)
  Top 0.254: TP202.P$1 v53.98,58.04
  Bottom 0.254: v53.98,58.04 J205.B9
RES0_4  (via drill 0.25)
  Top 0.254: TP203.P$1 v53.98,69.22
  Bottom 0.254: v53.98,69.22 J206.B9
RES1  (via drill 0.25)
  Top 0.254: J408.7 124.08,38.35 124.84,37.59 124.84,36.45 124.46,36.07 124.46,26.42 v122.56,24.51
  Bottom 0.254: v122.56,24.51 J402.B9
RES1_1  (via drill 0.25)
  Top 0.254: J308.7 89.79,38.35 90.55,37.59 90.55,36.45 90.17,36.07 90.17,26.42 v88.27,24.51
  Bottom 0.254: v88.27,24.51 J302.B9
RES1_2  (via drill 0.25)
  Top 0.254: J308.9 88.77,36.2 v88.27,35.69
  Bottom 0.254: v88.27,35.69 J303.B9
RES1_3  (via drill 0.25)
  Top 0.254: J308.1 88.77,43.05 88.9,43.18 88.9,43.81 88.27,44.45 v88.27,46.86
  Bottom 0.254: v88.27,46.86 J305.B9
RES1_4  (via drill 0.25)
  Top 0.254: J308.3 89.79,40.89 90.55,41.66 90.55,42.8 90.17,43.18 90.17,56.13 v88.27,58.04
  Bottom 0.254: v88.27,58.04 J306.B9
RES1_5  (via drill 0.25)
  Top 0.254: J308.5 90.55,39.62 91.06,40.13 91.06,42.8 91.44,43.18 91.44,58.42 88.9,60.96 88.9,68.58 v88.27,69.22
  Bottom 0.254: v88.27,69.22 J307.B9
RES2  (via drill 0.25)
  Top 0.254: J408.9 123.06,36.2 v122.56,35.69
  Bottom 0.254: v122.56,35.69 J403.B9
RES3  (via drill 0.25)
  Top 0.254: J408.1 123.06,43.05 123.19,43.18 123.19,43.94 122.56,44.58 v122.56,46.86
  Bottom 0.254: v122.56,46.86 J405.B9
RES3_0  (via drill 0.25)
  Top 0.254: J509.3 161.42,8.26 160.02,9.65 160.02,10.41 158.5,11.94 158.24,11.94 v156.84,13.34
  Bottom 0.254: J501.B9 v156.84,13.34
RES3_1  (via drill 0.25)
  Top 0.254: v156.84,24.51 158.75,26.42 158.75,35.94 159.38,36.58 159.38,37.97 159,38.35 J508.7
  Bottom 0.254: J502.B9 v156.84,24.51
RES3_2  (via drill 0.25)
  Top 0.254: J508.9 157.35,36.2 v156.84,35.69
  Bottom 0.254: v156.84,35.69 J503.B9
RES3_3  (via drill 0.25)
  Top 0.254: J508.1 157.35,42.93 157.48,43.05 157.48,44.2 156.84,44.83 v156.84,46.86
  Bottom 0.254: v156.84,46.86 J505.B9
RES3_4  (via drill 0.25)
  Top 0.254: J508.3 158.37,40.89 159.13,41.66 159.13,42.8 158.75,43.18 158.75,56.13 v156.84,58.04
  Bottom 0.254: v156.84,58.04 J506.B9
RES3_5  (via drill 0.25)
  Top 0.254: J508.5 159,39.62 159.64,40.26 159.64,42.8 160.02,43.18 160.02,58.55 157.48,61.09 157.48,68.58 v156.84,69.22
  Bottom 0.254: v156.84,69.22 J507.B9
RES4  (via drill 0.25)
  Top 0.254: J408.3 124.08,40.89 124.84,41.66 124.84,42.8 124.46,43.18 124.46,56.13 v122.56,58.04
  Bottom 0.254: v122.56,58.04 J406.B9
RES5  (via drill 0.25)
  Top 0.254: J408.5 124.71,39.62 125.35,40.26 125.35,42.8 125.73,43.18 125.73,58.67 123.19,61.21 123.19,68.58 v122.56,69.22
  Bottom 0.254: v122.56,69.22 J407.B9
RES6  (via drill 0.25)
  Top 0.254: v19.68,69.22 TP101.P$1
  Bottom 0.254: J108.B9 v19.68,69.22
RES_S_0  (via drill 0.25)
  Top 0.254: J110.3 58.8,7.75 57.15,9.4 57.15,10.41 55.37,12.19 55.12,12.19 v53.98,13.34
  Bottom 0.254: v53.98,13.34 J101.B9
RES_S_1  (via drill 0.25)
  Top 0.254: J109.7 18.03,27.18 17.78,26.92 17.78,15.24 v19.68,13.34
  Bottom 0.254: v19.68,13.34 J102.B9
RES_S_2  (via drill 0.25)
  Top 0.254: J109.9 19.68,25.91 v19.68,24.51
  Bottom 0.254: v19.68,24.51 J103.B9
RES_S_3  (via drill 0.25)
  Top 0.254: J109.1 19.05,30.99 19.05,35.05 v19.68,35.69
  Bottom 0.254: v19.68,35.69 J105.B9
RES_S_4  (via drill 0.25)
  Top 0.254: J109.3 18.03,29.72 17.78,29.97 17.78,44.96 v19.68,46.86
  Bottom 0.254: v19.68,46.86 J106.B9
RES_S_5  (via drill 0.25)
  Top 0.254: J109.5 17.78,28.45 16.51,29.72 16.51,54.86 v19.68,58.04
  Bottom 0.254: v19.68,58.04 J107.B9
SRCB_LED_EN  (via drill 0.25)
  Top 0.254: J104.B15 v23.5,78.11 | J110.7 56.26,7.75 54.61,9.4 54.61,10.41 54.23,10.79 53.98,10.79 v51.44,13.34